# EasyEDA Pro project ProProject_ESP32_lvgl_2024-08-28.epro

# Schematic Schematic1

## Sheets
1 P1: Create Date: 2024-05-08; Page Name: P1; Project Name: ESP32_lvgl; Schematic Name: Schematic1; Update Date: 2024-05-22; Company: 嘉立创EDA; Page Size: A4; Version: V1.0
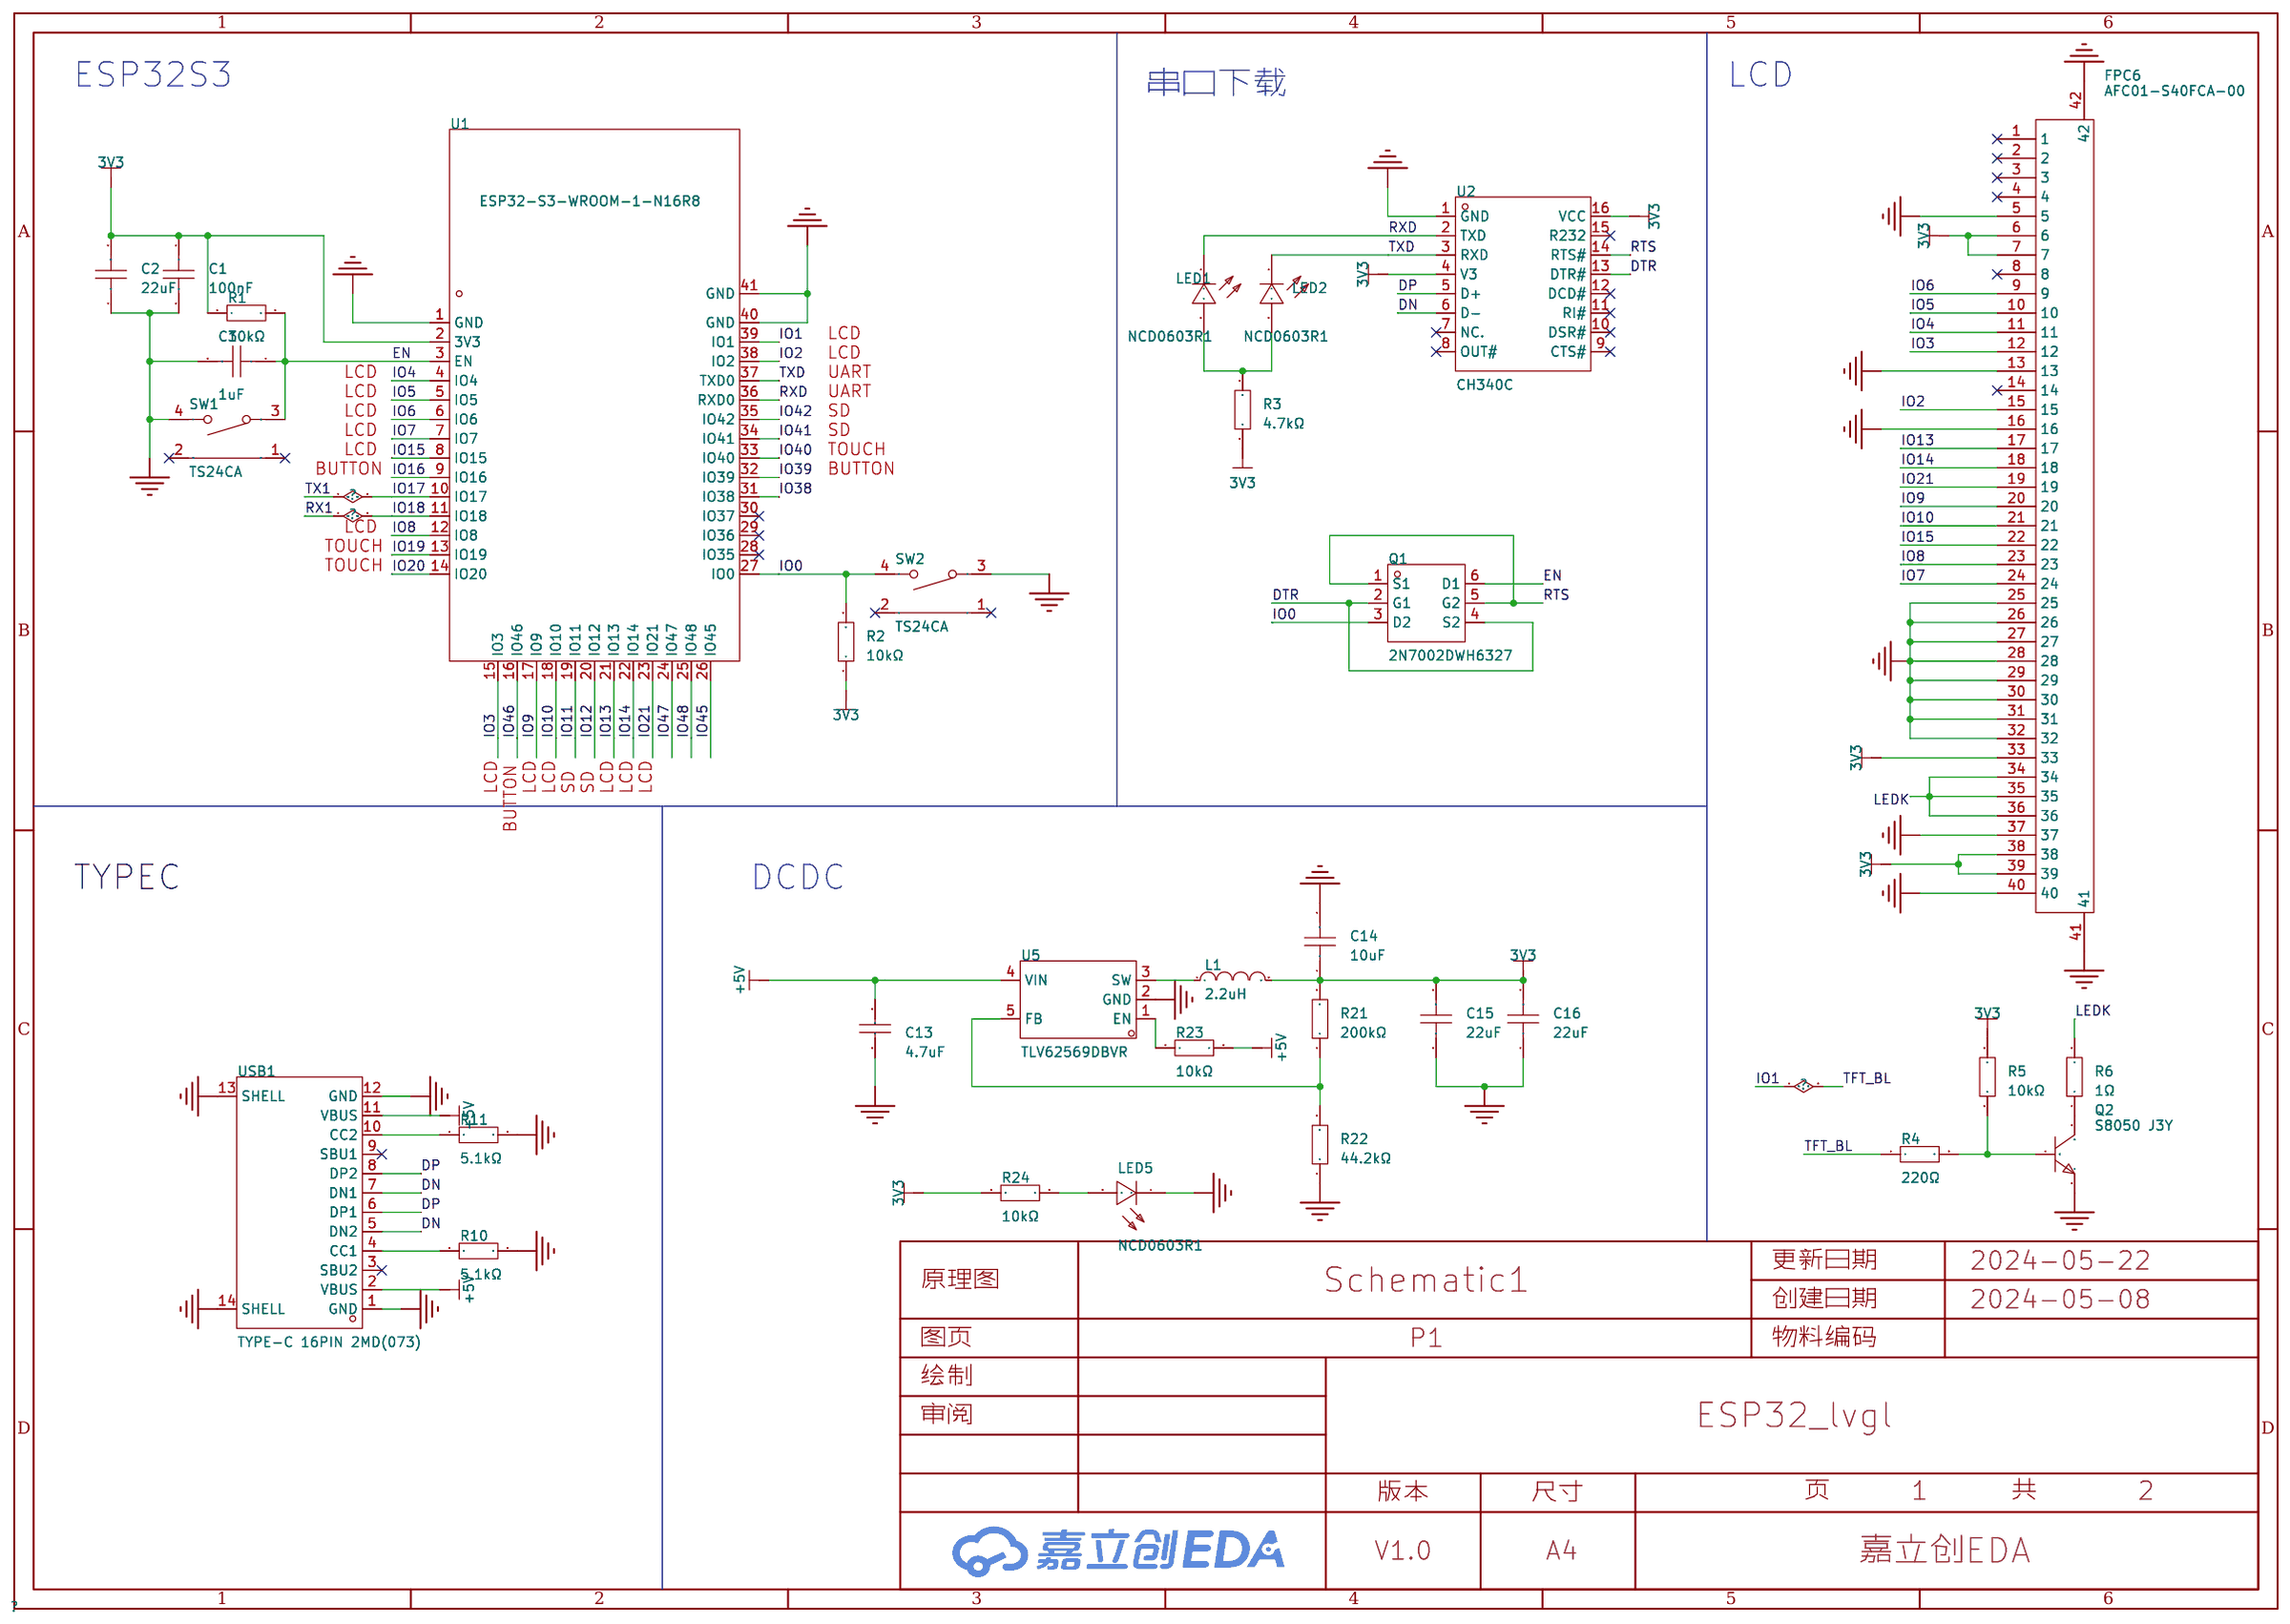
[diagram p0: P1]
2 P2: Create Date: 2024-05-10; Page Name: P2
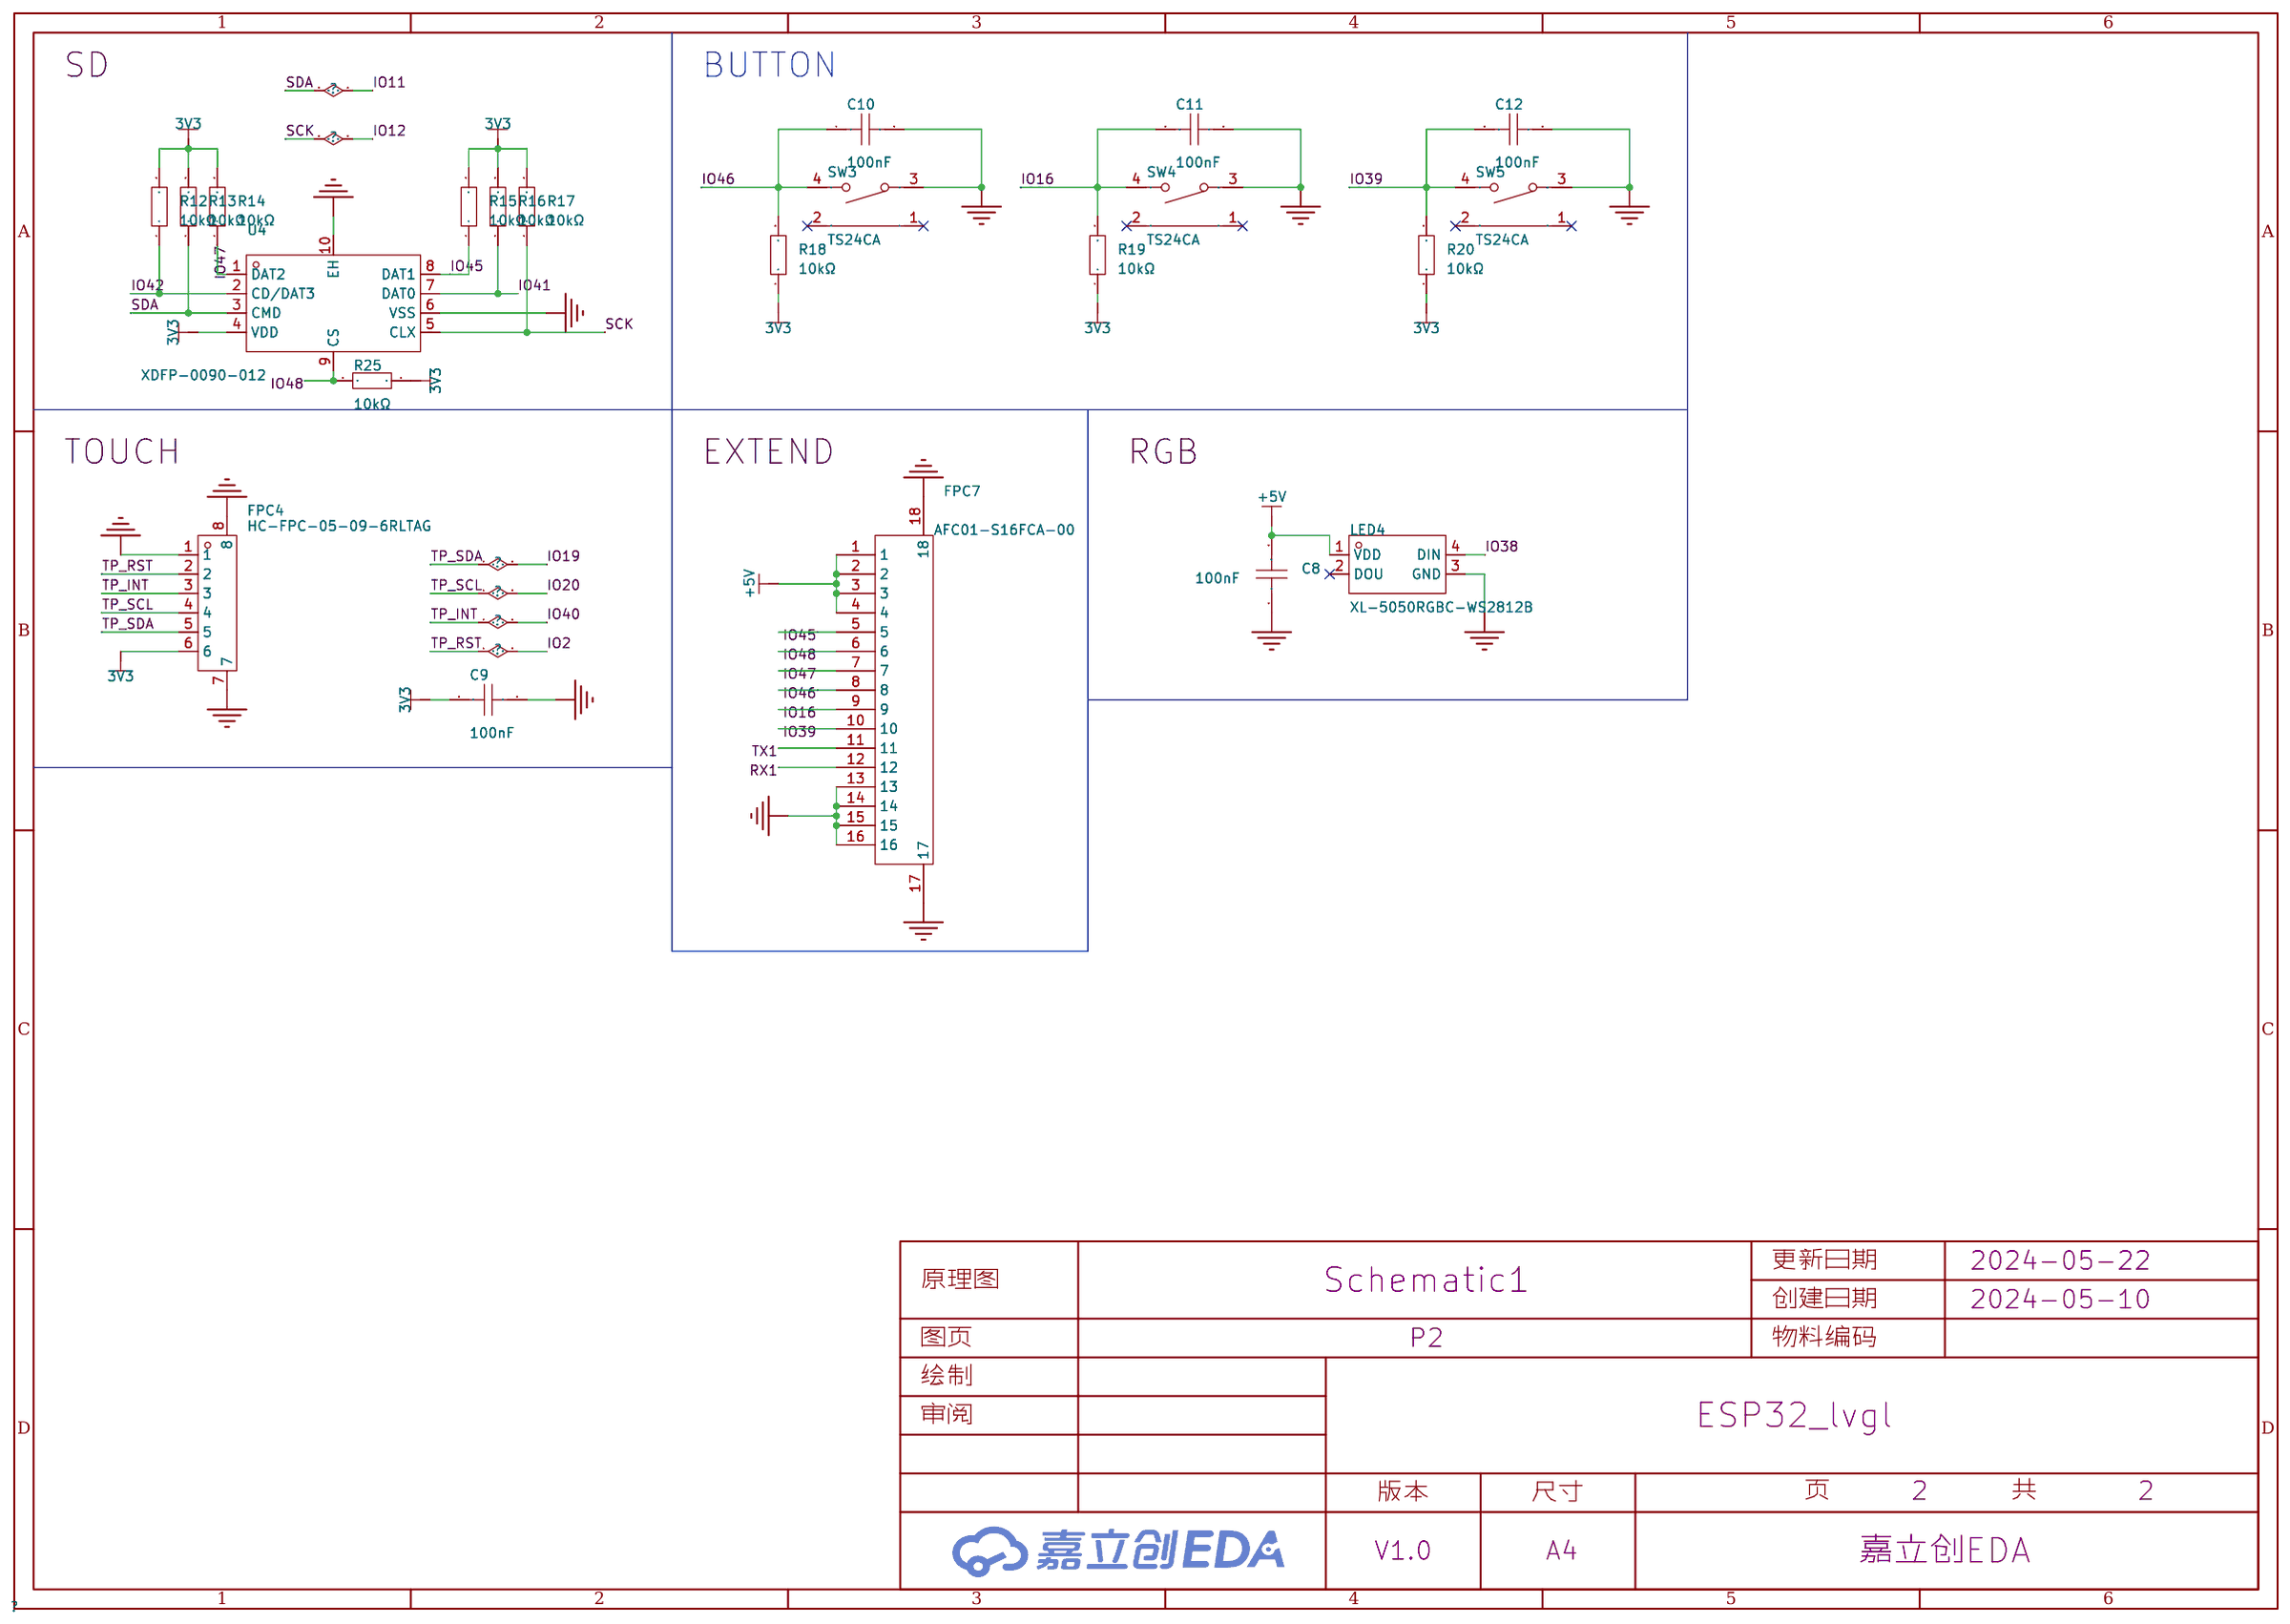
[diagram p1: P2]

## Parts
sheet P1
C1  100nF  [C0603]
C2  22uF  [C0603]
C3  1uF  [C0603]
C13  4.7uF  [C0805]
C14  10uF  [C0603]
C15  22uF  [C0603]
C16  22uF  [C0603]
FPC6  AFC01-S40FCA-00  [FPC-SMD_P0.50-40P_FGS-XJ-H2.0]
L1  2.2uH  [IND-SMD_L7.0-W6.6]
LED1  NCD0603R1  [LED0603-RD_RED]
LED2  NCD0603R1  [LED0603-RD_RED]
LED5  NCD0603R1  [LED0603-RD_RED]
Q1  2N7002DWH6327  [SOT-363_L2.0-W1.3-P0.65-LS2.1-BR]
Q2  S8050 J3Y  [SOT-23-3_L3.0-W1.7-P0.95-LS2.9-BR]
R1  10kΩ  [R0603]
R2  10kΩ  [R0603]
R3  4.7kΩ  [R0603]
R4  220Ω  [R0603]
R5  10kΩ  [R0603]
R6  1Ω  [R0603]
R10  5.1kΩ  [R0603]
R11  5.1kΩ  [R0603]
R21  200kΩ  [R0603]
R22  44.2kΩ  [R0603]
R23  10kΩ  [R0603]
R24  10kΩ  [R0603]
SW1  TS24CA  [SW-SMD_TS24CA]
SW2  TS24CA  [SW-SMD_TS24CA]
U1  ESP32-S3-WROOM-1-N16R8  [WIRELM-SMD_ESP32-S3-WROOM-1]
U2  CH340C  [SOP-16_L10.0-W3.9-P1.27-LS6.0-BL]
U5  TLV62569DBVR  [SOT-23-5_L3.0-W1.7-P0.95-LS2.8-BR]
USB1  TYPE-C 16PIN 2MD(073)  [USB-C-SMD_TYPE-C-6PIN-2MD-073]
sheet P2
C8  100nF  [C0603]
C9  100nF  [C0603]
C10  100nF  [C0603]
C11  100nF  [C0603]
C12  100nF  [C0603]
FPC4  HC-FPC-05-09-6RLTAG  [FPC-SMD_6P-P0.50_HC-FPC-05-09-6RLTAG]
FPC7  AFC01-S16FCA-00  [FPC-SMD_P0.50-16P_FGS-XJ-H2.0]
LED4  XL-5050RGBC-WS2812B  [LED-SMD_4P-L5.0-W5.0-BL_XL-5050RGBC]
R12  10kΩ  [R0603]
R13  10kΩ  [R0603]
R14  10kΩ  [R0603]
R15  10kΩ  [R0603]
R16  10kΩ  [R0603]
R17  10kΩ  [R0603]
R18  10kΩ  [R0603]
R19  10kΩ  [R0603]
R20  10kΩ  [R0603]
R25  10kΩ  [R0603]
SW3  TS24CA  [SW-SMD_TS24CA]
SW4  TS24CA  [SW-SMD_TS24CA]
SW5  TS24CA  [SW-SMD_TS24CA]
U4  XDFP-0090-012  [SIM-SMD_LX_XDFP-0090-012]

## Library data of the parts
C1 C8-C12 = CC0603KRX7R9BB104: 容值:100nF;精度:±10%;额定电压:50V;材质(温度系数):X7R;; LCSC Part Name: 100nF ±10% 50V; Supplier Part: C14663; Manufacturer: YAGEO(国巨); Supplier Footprint: 0603; JLCPCB Part Class: 基础库; Datasheet: https://atta.szlcsc.com/upload/public/pdf/source/20180910/C282072_33301C7F631E79921B82A8DAC6BCC5B3.pdf; Supplier: LCSC; Tolerance: ±10%; Voltage Rated: 50V; Temperature Coefficient: X7R
C2 = CL10A226MP8NUNE: 容值:22uF;精度:±20%;额定电压:10V;材质(温度系数):X5R;; LCSC Part Name: 22uF ±20% 10V; Supplier Part: C86295; Manufacturer: SAMSUNG(三星); Supplier Footprint: 0603; JLCPCB Part Class: 扩展库; Datasheet: https://atta.szlcsc.com/upload/public/pdf/source/20160218/1457707763339.pdf; Supplier: LCSC; Tolerance: ±20%; Voltage Rated: 10V; Temperature Coefficient: X5R
C3 = CL10A105KB8NNNC: 容值:1uF;精度:±10%;额定电压:50V;材质(温度系数):X5R;; LCSC Part Name: 1uF ±10% 50V; Supplier Part: C15849; Manufacturer: SAMSUNG(三星); Supplier Footprint: 0603; JLCPCB Part Class: 基础库; Datasheet: https://atta.szlcsc.com/upload/public/pdf/source/20160218/1457707763339.pdf; Supplier: LCSC; Tolerance: ±10%; Voltage Rated: 50V; Temperature Coefficient: X5R
C13 = CL21A475KAQNNNE: 容值:4.7uF;精度:±10%;额定电压:25V;材质(温度系数):X5R;; LCSC Part Name: 4.7uF ±10% 25V; Supplier Part: C1779; Manufacturer: SAMSUNG(三星); Supplier Footprint: 0805; JLCPCB Part Class: 基础库; Datasheet: https://atta.szlcsc.com/upload/public/pdf/source/20160218/1457707763339.pdf; Supplier: LCSC; Tolerance: ±10%; Voltage Rated: 25V; Temperature Coefficient: X5R
C14 = CL10A106MQ8NNNC: 容值:10uF;精度:±20%;额定电压:6.3V;材质(温度系数):X5R;; LCSC Part Name: 10uF ±20% 6.3V; Supplier Part: C1691; Manufacturer: SAMSUNG(三星); Supplier Footprint: 0603; JLCPCB Part Class: 扩展库; Datasheet: https://atta.szlcsc.com/upload/public/pdf/source/20160218/1457707763339.pdf; Supplier: LCSC; Tolerance: ±20%; Voltage Rated: 6.3V; Temperature Coefficient: X5R
C15 C16 = CL10A226MQ8NRNC: 容值:22uF;精度:±20%;额定电压:6.3V;材质(温度系数):X5R;; LCSC Part Name: 22uF ±20% 6.3V; Supplier Part: C59461; Manufacturer: SAMSUNG(三星); Supplier Footprint: 0603; JLCPCB Part Class: 基础库; Datasheet: https://atta.szlcsc.com/upload/public/pdf/source/20160218/1457707763339.pdf; Supplier: LCSC; Tolerance: ±20%; Voltage Rated: 6.3V; Temperature Coefficient: X5R
FPC6 = AFC01-S40FCA-00: 锁定特性:翻盖式;触点类型:下接;触点数量:40P;间距:0.5mm;安装类型:卧贴;; LCSC Part Name: 间距:0.5mm P数:40P 翻盖式 下接; Supplier Part: C262674; Manufacturer: JS(钜硕电子); Supplier Footprint: SMD,P=0.5mm,卧贴; JLCPCB Part Class: 扩展库; Datasheet: https://atta.szlcsc.com/upload/public/pdf/source/20190816/C413942_2A72D1AC756EAE17EEDF756A339D4500.pdf; Supplier: LCSC; Locking Feature: 翻盖式; Contact Type: 下接; Number of Contacts: 40P; Pitch: 0.5mm; Mounting Type: 卧贴; FFC, FCB Thickness: 0.3mm; Height Above Board: 2mm
L1 = FXL0630-2R2-M: 电感值:2.2uH;精度:±20%;额定电流:9.5A;饱和电流(Isat):10A;类型:一体成型电感;; LCSC Part Name: 2.2uH ±20% 10A; Supplier Part: C167218; Manufacturer: cjiang(长江微电); Supplier Footprint: SMD,6.6x7mm; JLCPCB Part Class: 扩展库; Datasheet: https://atta.szlcsc.com/upload/public/pdf/source/20230516/3A080F5AF8C87BB81C3BA86E5F60E51A.pdf; Supplier: LCSC; Tolerance: ±20%; Rated Current: 9.5A; Saturation Current (Isat): 10A; DC Resistance (DCR): 15mΩ; Type: 一体成型电感
LED1 LED2 LED5 = NCD0603R1_C84263: 灯头类型:-;发光颜色:红色;正向电压(VF):1.6V~2.6V;功率:65mW;正向电流:20mA;主波长:615nm~630nm;二极管配置:独立二极管;透镜颜色:无色透明透镜;色温:-;发光强度:80mcd~220mcd;发光角度:130°;载带方式:-;工作温度:-30℃~+85℃;; Supplier Part: C84263; Manufacturer: 国星光电; Supplier Footprint: 0603; JLCPCB Part Class: 扩展库; Datasheet: https://atta.szlcsc.com/upload/public/pdf/source/20200820/C84263_DABC6A75E58F576973B407FDBA283D60.pdf; Supplier: LCSC; Emitted Color: 红色; Forward Voltage (VF): 1.6V~2.6V; Power Dissipation: 65mW; Forward Current: 20mA; Dominant Wavelength: 615nm~630nm; Diode Configuration: 独立二极管; Lens Color: 无色透明透镜; Luminous Intensity: 80mcd~220mcd; Viewing Angle: 130°; Operating Temperature: -30℃~+85℃
Q1 = 2N7002DWH6327: 类型:2个N沟道;漏源电压(Vdss):60V;连续漏极电流(Id):300mA;功率(Pd):500mW;导通电阻(RDS(on)@Vgs,Id):3Ω@10V,500mA;阈值电压(Vgs(th)@Id):2.5V@250uA;; LCSC Part Name: 2个N沟道 耐压:60V 电流:300mA; Supplier Part: C151535; Manufacturer: Infineon(英飞凌); Supplier Footprint: SC-70-6(SOT-363); JLCPCB Part Class: 扩展库; Datasheet: https://atta.szlcsc.com/upload/public/pdf/source/20180112/C151535_15157256538381261466.pdf; Supplier: LCSC; Type: 2个N沟道; Drain Source Voltage (Vdss): 60V; Continuous Drain Current (Id): 300mA; Power Dissipation (Pd): 500mW; Drain Source On Resistance (RDS(on)@Vgs,Id): 3Ω@10V,500mA; Gate Threshold Voltage (Vgs(th)@Id): 2.5V@250uA
Q2 = S8050 J3Y_C2146: 晶体管类型:NPN;集电极电流(Ic):500mA;集射极击穿电压(Vceo):25V;功率(Pd):300mW;直流电流增益(hFE@Ic,Vce):200@50mA,1V;; LCSC Part Name: S8050 J3Y(RANGE:200-350) H档(200-350); Supplier Part: C2146; Manufacturer: CJ(江苏长电/长晶); Supplier Footprint: SOT-23; JLCPCB Part Class: 基础库; Datasheet: https://atta.szlcsc.com/upload/public/pdf/source/20140809/1457707209234.pdf; Supplier: LCSC; Transistor Type: NPN; Collector Current (Ic): 500mA; Collector-Emitter Breakdown Voltage (Vceo): 25V; Power Dissipation (Pd): 300mW; DC Current Gain (hFE@Ic,Vce): 200@50mA,1V; Transition Frequency (fT): 150MHz; Collector Cut-Off Current (Icbo): 100nA; Collector-Emitter Saturation Voltage (VCE(sat)@Ic,Ib): 600mV@500mA,50mA
R1 R2 R5 R12-R20 R23-R25 = 0603WAF1002T5E: 电阻类型:厚膜电阻;阻值:10kΩ;精度:±1%;功率:100mW;最大工作电压:75V;温度系数:±100ppm/℃;; LCSC Part Name: 厚膜电阻 10kΩ ±1% 100mW; Supplier Part: C25804; Manufacturer: UNI-ROYAL(厚声); Supplier Footprint: 0603; JLCPCB Part Class: 基础库; Datasheet: https://atta.szlcsc.com/upload/public/pdf/source/20200306/C422600_1E6D84923E4A46A82E41ADD87F860B5C.pdf; Supplier: LCSC; Type: 厚膜电阻; Tolerance: ±1%; Power(Watts): 100mW; Overload Voltage (Max): 75V; Temperature Coefficient: ±100ppm/℃; Operating Temperature Range: -55℃~+155℃
R3 = 0603WAF4701T5E: 电阻类型:厚膜电阻;阻值:4.7kΩ;精度:±1%;功率:100mW;最大工作电压:75V;温度系数:±100ppm/℃;; LCSC Part Name: 4.7kΩ ±1% 100mW 厚膜电阻; Supplier Part: C23162; Manufacturer: UNI-ROYAL(厚声); Supplier Footprint: 0603; JLCPCB Part Class: 基础库; Datasheet: https://atta.szlcsc.com/upload/public/pdf/source/20200306/C422600_1E6D84923E4A46A82E41ADD87F860B5C.pdf; Supplier: LCSC; Type: 厚膜电阻; Tolerance: ±1%; Power(Watts): 100mW; Overload Voltage (Max): 75V; Temperature Coefficient: ±100ppm/℃; Operating Temperature Range: -55℃~+155℃
R4 = 0603WAF2200T5E: 电阻类型:厚膜电阻;阻值:220Ω;精度:±1%;功率:100mW;最大工作电压:75V;温度系数:±100ppm/℃;; LCSC Part Name: 220Ω ±1% 100mW 厚膜电阻; Supplier Part: C22962; Manufacturer: UNI-ROYAL(厚声); Supplier Footprint: 0603; JLCPCB Part Class: 基础库; Datasheet: https://atta.szlcsc.com/upload/public/pdf/source/20200306/C422600_1E6D84923E4A46A82E41ADD87F860B5C.pdf; Supplier: LCSC; Type: 厚膜电阻; Tolerance: ±1%; Power(Watts): 100mW; Overload Voltage (Max): 75V; Temperature Coefficient: ±100ppm/℃; Operating Temperature Range: -55℃~+155℃
R6 = 0603WAF100KT5E: 电阻类型:厚膜电阻;阻值:1Ω;精度:±1%;功率:100mW;最大工作电压:75V;温度系数:±400ppm/℃;; LCSC Part Name: 1Ω ±1% 100mW 厚膜电阻; Supplier Part: C22936; Manufacturer: UNI-ROYAL(厚声); Supplier Footprint: 0603; JLCPCB Part Class: 基础库; Datasheet: https://atta.szlcsc.com/upload/public/pdf/source/20200306/C422600_1E6D84923E4A46A82E41ADD87F860B5C.pdf; Supplier: LCSC; Type: 厚膜电阻; Tolerance: ±1%; Power(Watts): 100mW; Overload Voltage (Max): 75V; Temperature Coefficient: ±400ppm/℃; Operating Temperature Range: -55℃~+155℃
R10 R11 = 0603WAF5101T5E: 电阻类型:厚膜电阻;阻值:5.1kΩ;精度:±1%;功率:100mW;最大工作电压:75V;温度系数:±100ppm/℃;; LCSC Part Name: 5.1kΩ ±1% 100mW 厚膜电阻; Supplier Part: C23186; Manufacturer: UNI-ROYAL(厚声); Supplier Footprint: 0603; JLCPCB Part Class: Basic Part; Datasheet: https://atta.szlcsc.com/upload/public/pdf/source/20200306/C422600_1E6D84923E4A46A82E41ADD87F860B5C.pdf; Supplier: LCSC; Type: 厚膜电阻; Tolerance: ±1%; Power(Watts): 100mW; Overload Voltage (Max): 75V; Temperature Coefficient: ±100ppm/℃; Operating Temperature Range: -55℃~+155℃
R21 = 0603WAF2003T5E: 电阻类型:厚膜电阻;阻值:200kΩ;精度:±1%;功率:100mW;最大工作电压:75V;温度系数:±100ppm/℃;; LCSC Part Name: 200kΩ ±1% 100mW 厚膜电阻; Supplier Part: C25811; Manufacturer: UNI-ROYAL(厚声); Supplier Footprint: 0603; JLCPCB Part Class: 基础库; Datasheet: https://atta.szlcsc.com/upload/public/pdf/source/20200306/C422600_1E6D84923E4A46A82E41ADD87F860B5C.pdf; Supplier: LCSC; Type: 厚膜电阻; Tolerance: ±1%; Power(Watts): 100mW; Overload Voltage (Max): 75V; Temperature Coefficient: ±100ppm/℃; Operating Temperature Range: -55℃~+155℃
R22 = 0603WAF4422T5E: 电阻类型:厚膜电阻;阻值:44.2kΩ;精度:±1%;功率:100mW;最大工作电压:75V;温度系数:±100ppm/℃;; LCSC Part Name: 44.2kΩ ±1% 100mW 厚膜电阻; Supplier Part: C23056; Manufacturer: UNI-ROYAL(厚声); Supplier Footprint: 0603; JLCPCB Part Class: 扩展库; Datasheet: https://atta.szlcsc.com/upload/public/pdf/source/20200306/C422600_1E6D84923E4A46A82E41ADD87F860B5C.pdf; Supplier: LCSC; Type: 厚膜电阻; Tolerance: ±1%; Power(Watts): 100mW; Overload Voltage (Max): 75V; Temperature Coefficient: ±100ppm/℃; Operating Temperature Range: -55℃~+155℃
SW1-SW5 = TS24CA: 电路结构:单刀单掷;按钮形状:矩形按钮;安装方式:卧贴;开关长度:4.55mm;开关宽度:1.8mm;开关高度:3.5mm;触点电流:50mA;额定电压(DC):12V;带灯:-;机械寿命:-;; LCSC Part Name: 4.55*1.8*3.5mm 卧贴 轻触开关; Supplier Part: C393942; Manufacturer: SHOU HAN(首韩); Supplier Footprint: SMD; JLCPCB Part Class: 扩展库; Datasheet: https://atta.szlcsc.com/upload/public/pdf/source/20190521/C393942_591A9E318887EFA4274D34029981AD99.pdf; Supplier: LCSC; Circuit: 单刀单掷; Actuator Style: 矩形按钮; Mounting Style: 卧贴; Switch Length: 4.55mm; Switch Width: 1.8mm; Switch Height: 3.5mm; Contact Current: 50mA; Voltage Rating (DC): 12V
U1 = ESP32-S3-WROOM-1-N16R8: LCSC Part Name: 通用型Wi-Fi+低功耗蓝牙MCU模组; Supplier Part: C2913202; Manufacturer: ESPRESSIF(乐鑫); Supplier Footprint: SMD,18x25.5mm; JLCPCB Part Class: 扩展库; Datasheet: https://atta.szlcsc.com/upload/public/pdf/source/20220705/4E799F39581577F766659887F738A439.pdf; Supplier: LCSC
U2 = CH340C: 应用功能:收发器;接口协议:USB 2.0;数据速率:2Mbps;; LCSC Part Name: CH340C USB转串口芯片 CH340; Supplier Part: C84681; Manufacturer: WCH(南京沁恒); Supplier Footprint: SOP-16; JLCPCB Part Class: 扩展库; Datasheet: https://atta.szlcsc.com/upload/public/pdf/source/20200819/C84681_ADBED554CE321879DBD6B1D06488689C.pdf; Supplier: LCSC; Applications Function: 收发器; Protocol: USB 2.0; Supply Voltage: 3.3V；5V; Data Rate: 2Mbps
U5 = TLV62569DBVR: 功能类型:降压型;输出类型:可调;输入电压:2.5V~5.5V;输出电压:600mV~5.5V;输出电流(最大值):2A;; Supplier Part: C141836; Manufacturer: TI(德州仪器); Supplier Footprint: SOT-23-5; JLCPCB Part Class: 扩展库; Datasheet: https://www.ti.com/cn/lit/gpn/tlv62569; Supplier: LCSC; Function: 降压型; Output Type: 可调; Input Voltage: 2.5V~5.5V; Output Voltage: 600mV~5.5V; Output Current (Max): 2A; Switching Frequency: 1.5MHz; Operating Temperature: -40℃~+125℃@(TJ); Synchronous Rectification: 是; Topology: 降压式; Switch tube (built-in/external): 内置
USB1 = TYPE-C 16PIN 2MD(073): 连接器类型:Type-C;标准:-;公母:母;端口数量:1;触点数量:16P;安装方式:卧贴;额定电流 - 电源:5A;工作温度范围:-25℃~+85℃;; LCSC Part Name: Type-C 母 卧贴; Supplier Part: C2765186; Manufacturer: SHOU HAN(首韩); Supplier Footprint: SMD; JLCPCB Part Class: 扩展库; Datasheet: https://atta.szlcsc.com/upload/public/pdf/source/20211123/39B17C16241EAC15C5E277BDA434118E.pdf; Supplier: LCSC; Connector Type: Type-C; Gender: 母; Number of Ports: 1; Number of Contacts: 16P; Mounting Style: 卧贴; Current Rating - Power (Max): 5A; Operating Temperature Range: -25℃~+85℃
FPC4 = HC-FPC-05-09-6RLTAG: 锁定特性:翻盖式;触点类型:双侧触点/上下接;触点数量:6P;间距:0.5mm;安装类型:卧贴;工作温度范围:-55℃~+85℃;; LCSC Part Name: 翻盖式 双侧触点/上下接 P数:6P 间距:0.5mm; Supplier Part: C5213748; Manufacturer: HCTL(华灿天禄); Supplier Footprint: SMD,P=0.5mm,卧贴; JLCPCB Part Class: 扩展库; Datasheet: https://atta.szlcsc.com/upload/public/pdf/source/20221026/52A26161A88FCE07A06989F8D4399614.pdf; Supplier: LCSC; Locking Feature: 翻盖式; Contact Type: 双侧触点/上下接; Number of Contacts: 6P; Pitch: 0.5mm; Mounting Type: 卧贴; FFC, FCB Thickness: 0.3mm; Height Above Board: 1mm; Contact Material: 铜合金; Operating Temperature Range: -55℃~+85℃
FPC7 = AFC01-S16FCA-00: 锁定特性:翻盖式;触点类型:下接;触点数量:16P;间距:0.5mm;安装类型:卧贴;; LCSC Part Name: 间距:0.5mm P数:16P 翻盖式 下接; Supplier Part: C262665; Manufacturer: JS(钜硕电子); Supplier Footprint: SMD,P=0.5mm,卧贴; JLCPCB Part Class: 扩展库; Datasheet: https://atta.szlcsc.com/upload/public/pdf/source/20190816/C413942_2A72D1AC756EAE17EEDF756A339D4500.pdf; Supplier: LCSC; Locking Feature: 翻盖式; Contact Type: 下接; Number of Contacts: 16P; Pitch: 0.5mm; Mounting Type: 卧贴; FFC, FCB Thickness: 0.3mm; Height Above Board: 2mm
LED4 = XL-5050RGBC-WS2812B: 5050七彩幻彩透明贴片LED灯珠 5050 幻彩透明四脚 ws2812B 内置驱动IC; Supplier Part: C2843785; Manufacturer: XINGLIGHT(成兴光); Supplier Footprint: SMD5050; JLCPCB Part Class: 扩展库; Datasheet: https://atta.szlcsc.com/upload/public/pdf/source/20240412/E1004CAA80592E31D08BFE019083806F.pdf; Supplier: LCSC
U4 = XDFP-0090-012: 卡连接方式:自弹式;本体最大高度:1.85mm;触头镀层:金;; LCSC Part Name: 自弹式外焊 Micro SD卡座/TF卡座9PIN; Supplier Part: C7498122; Manufacturer: LX(连欣科技); Supplier Footprint: SMD; JLCPCB Part Class: 扩展库; Datasheet: https://atta.szlcsc.com/upload/public/pdf/source/20230919/3284334F72F9F9D639C35504FE7D1962.pdf; Supplier: LCSC; Card Connection Mode: 自弹式; Body Height (Max): 1.85mm; Contact Plating: 金

## Nets
3V3: C1.1 C2.2 C9.2 C14.1 C15.2 C16.2 FPC4.6 FPC6.6 FPC6.7 FPC6.33 FPC6.38 FPC6.39 L1.2 R1.1 R2.1 R3.1 R5.2 R12.2 R13.2 R14.2 R15.2 R16.2 R17.2 R18.1 R19.1 R20.1 R21.2 R24.1 R25.1 U1.2(3V3) U2.4(V3) U2.16(VCC) U4.4(VDD)
+5V: C8.2 C13.2 FPC7.1 FPC7.2 FPC7.3 FPC7.4 LED4.1(VDD) R23.2 U5.4(VIN) USB1.2(VBUS) USB1.11(VBUS)
GND: C1.2 C2.1 C3.2 C8.1 C9.1 C10.2 C11.2 C12.2 C13.1 C14.2 C15.1 C16.1 FPC4.1 FPC4.7 FPC4.8 FPC6.5 FPC6.13 FPC6.16 FPC6.25 FPC6.26 FPC6.27 FPC6.28 FPC6.29 FPC6.30 FPC6.31 FPC6.32 FPC6.37 FPC6.40 FPC6.41 FPC6.42 FPC7.13 FPC7.14 FPC7.15 FPC7.16 FPC7.17 FPC7.18 LED4.3(GND) LED5.1(K) Q2.2(E) R10.2 R11.2 R22.1 SW1.4 SW2.3 SW3.3 SW4.3 SW5.3 U1.1(GND) U1.40(GND) U1.41(GND) U2.1(GND) U4.6(VSS) U4.10(EH) U5.2(GND) USB1.1(GND) USB1.12(GND) USB1.13(SHELL) USB1.14(SHELL)
DN: U2.6(D-) USB1.5(DN2) USB1.7(DN1)
DP: U2.5(D+) USB1.6(DP1) USB1.8(DP2)
DTR: Q1.2(G1) Q1.4(S2) U2.13(DTR#)
EN: C3.1 Q1.6(D1) R1.2 SW1.3 U1.3(EN)
IO0: Q1.3(D2) R2.2 SW2.4 U1.27(IO0)
IO1: R4.1 U1.39(IO1)
IO2: FPC4.2 FPC6.15 U1.38(IO2)
IO3: FPC6.12 U1.15(IO3)
IO4: FPC6.11 U1.4(IO4)
IO5: FPC6.10 U1.5(IO5)
IO6: FPC6.9 U1.6(IO6)
IO7: FPC6.24 U1.7(IO7)
IO8: FPC6.23 U1.12(IO8)
IO9: FPC6.20 U1.17(IO9)
IO10: FPC6.21 U1.18(IO10)
IO11: R13.1 U1.19(IO11) U4.3(CMD)
IO12: R17.1 U1.20(IO12) U4.5(CLX)
IO13: FPC6.17 U1.21(IO13)
IO14: FPC6.18 U1.22(IO14)
IO15: FPC6.22 U1.8(IO15)
IO16: C11.1 FPC7.9 R19.2 SW4.4 U1.9(IO16)
IO17: FPC7.11 U1.10(IO17)
IO18: FPC7.12 U1.11(IO18)
IO19: FPC4.5 U1.13(IO19)
IO20: FPC4.4 U1.14(IO20)
IO21: FPC6.19 U1.23(IO21)
IO38: LED4.4(DIN) U1.31(IO38)
IO39: C12.1 FPC7.10 R20.2 SW5.4 U1.32(IO39)
IO40: FPC4.3 U1.33(IO40)
IO41: R16.1 U1.34(IO41) U4.7(DAT0)
IO42: R12.1 U1.35(IO42) U4.2(CD/DAT3)
IO45: FPC7.5 R15.1 U1.26(IO45) U4.8(DAT1)
IO46: C10.1 FPC7.8 R18.2 SW3.4 U1.16(IO46)
IO47: FPC7.7 R14.1 U1.24(IO47) U4.1(DAT2)
IO48: FPC7.6 R25.2 U1.25(IO48) U4.9(CS)
LEDK: FPC6.34 FPC6.35 FPC6.36 R6.2
RTS: Q1.1(S1) Q1.5(G2) U2.14(RTS#)
RXD: LED1.1(K) U1.36(RXD0) U2.2(TXD)
TXD: LED2.1(K) U1.37(TXD0) U2.3(RXD)
$1N3136: LED1.2(A) LED2.2(A) R3.2
$1N4482: Q2.3(C) R6.1
$1N4584: Q2.1(B) R4.2 R5.1
$1N6260: R10.1 USB1.4(CC1)
$1N6275: R11.1 USB1.10(CC2)
$1N13069: L1.1 U5.3(SW)
$1N13305: R23.1 U5.1(EN)
$1N13462: LED5.2(A) R24.2
$1N13468: R21.1 R22.2 U5.5(FB)

Not connected (* = marked no-connect by the designer): FPC6 1* 2* 3* 4* 8* 14*; LED4 2(DOU)*; SW1 1* 2*; SW2 1* 2*; SW3 1* 2*; SW4 1* 2*; SW5 1* 2*; U1 28(IO35)* 29(IO36)* 30(IO37)*; U2 7(NC.)* 8(OUT#)* 9(CTS#)* 10(DSR#)* 11(RI#)* 12(DCD#)* 15(R232)*; USB1 3(SBU2)* 9(SBU1)*

## Notes on the sheets
sheet 1
- ESP32S3
- LCD
- 串口下载
- LCD
- LCD
- LCD
- UART
- LCD
- UART
- LCD
- SD
- LCD
- LCD
- SD
- TOUCH
- BUTTON
- BUTTON
- LCD
- TOUCH
- TOUCH
- LCD
- LCD
- LCD
- SD
- SD
- LCD
- LCD
- LCD
- BUTTON
- TYPEC
- DCDC
sheet 2
- SD
- BUTTON
- TOUCH
- EXTEND
- RGB

# Board PCB1
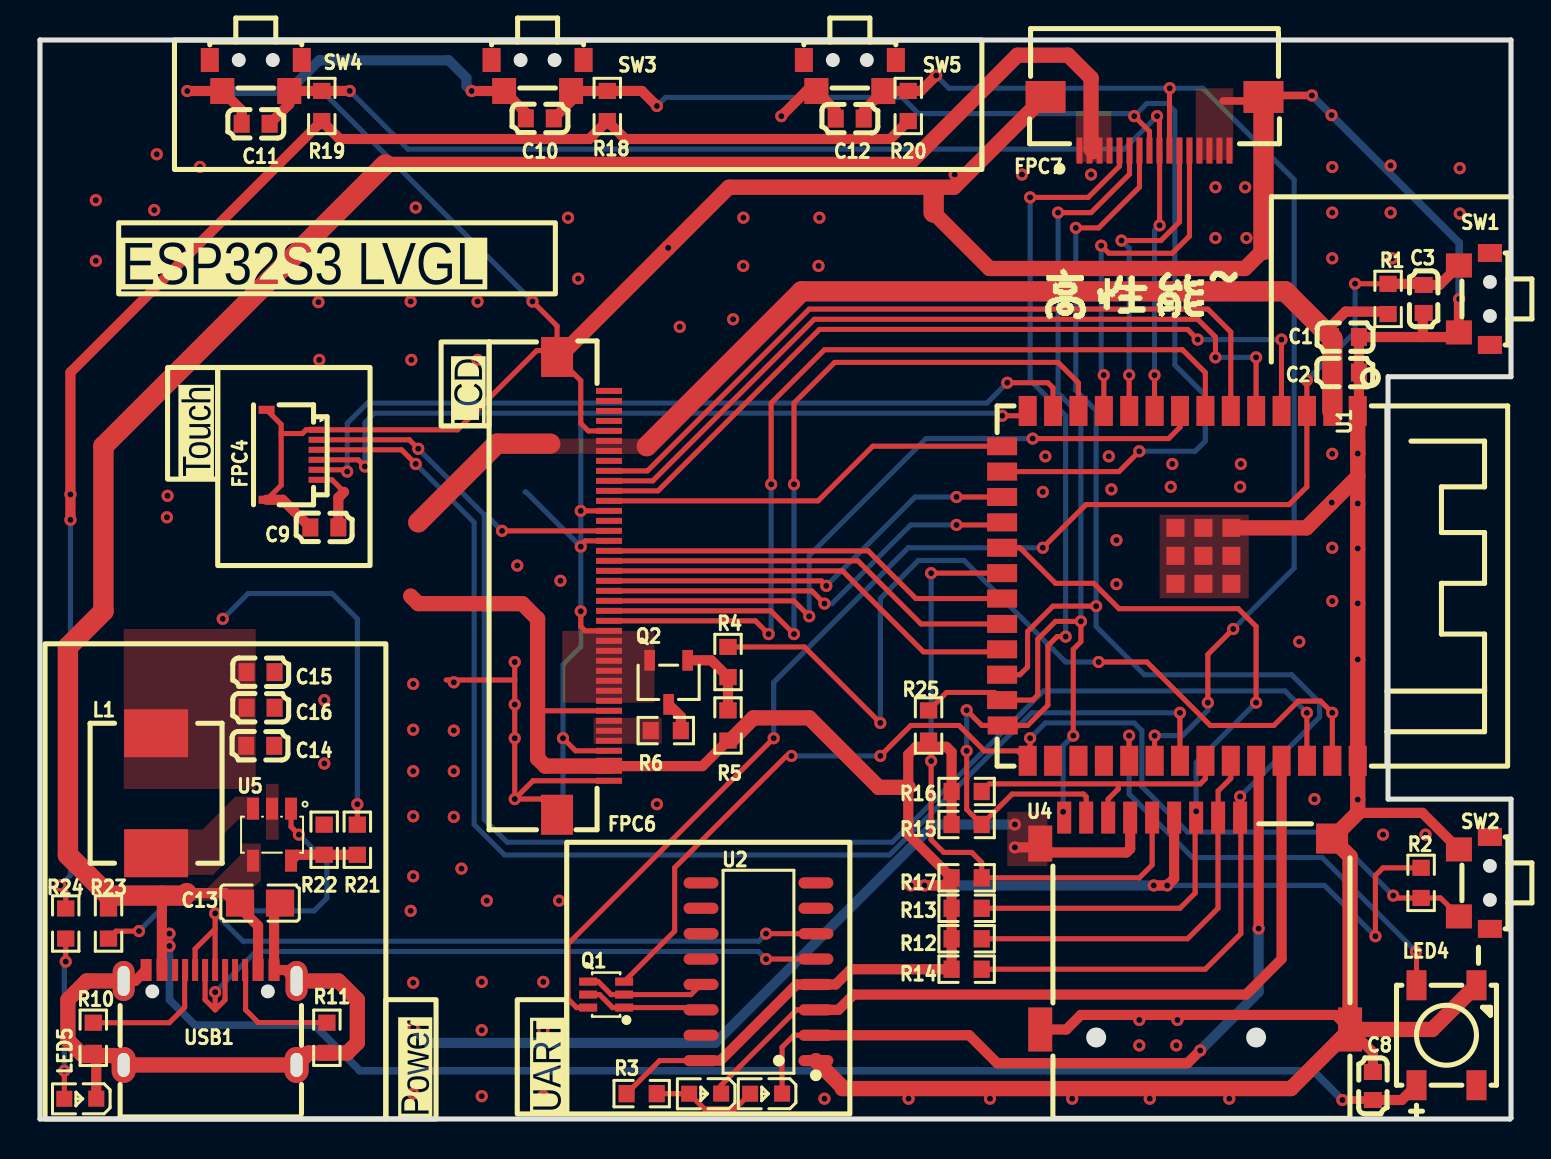
[diagram p2: board, top side]
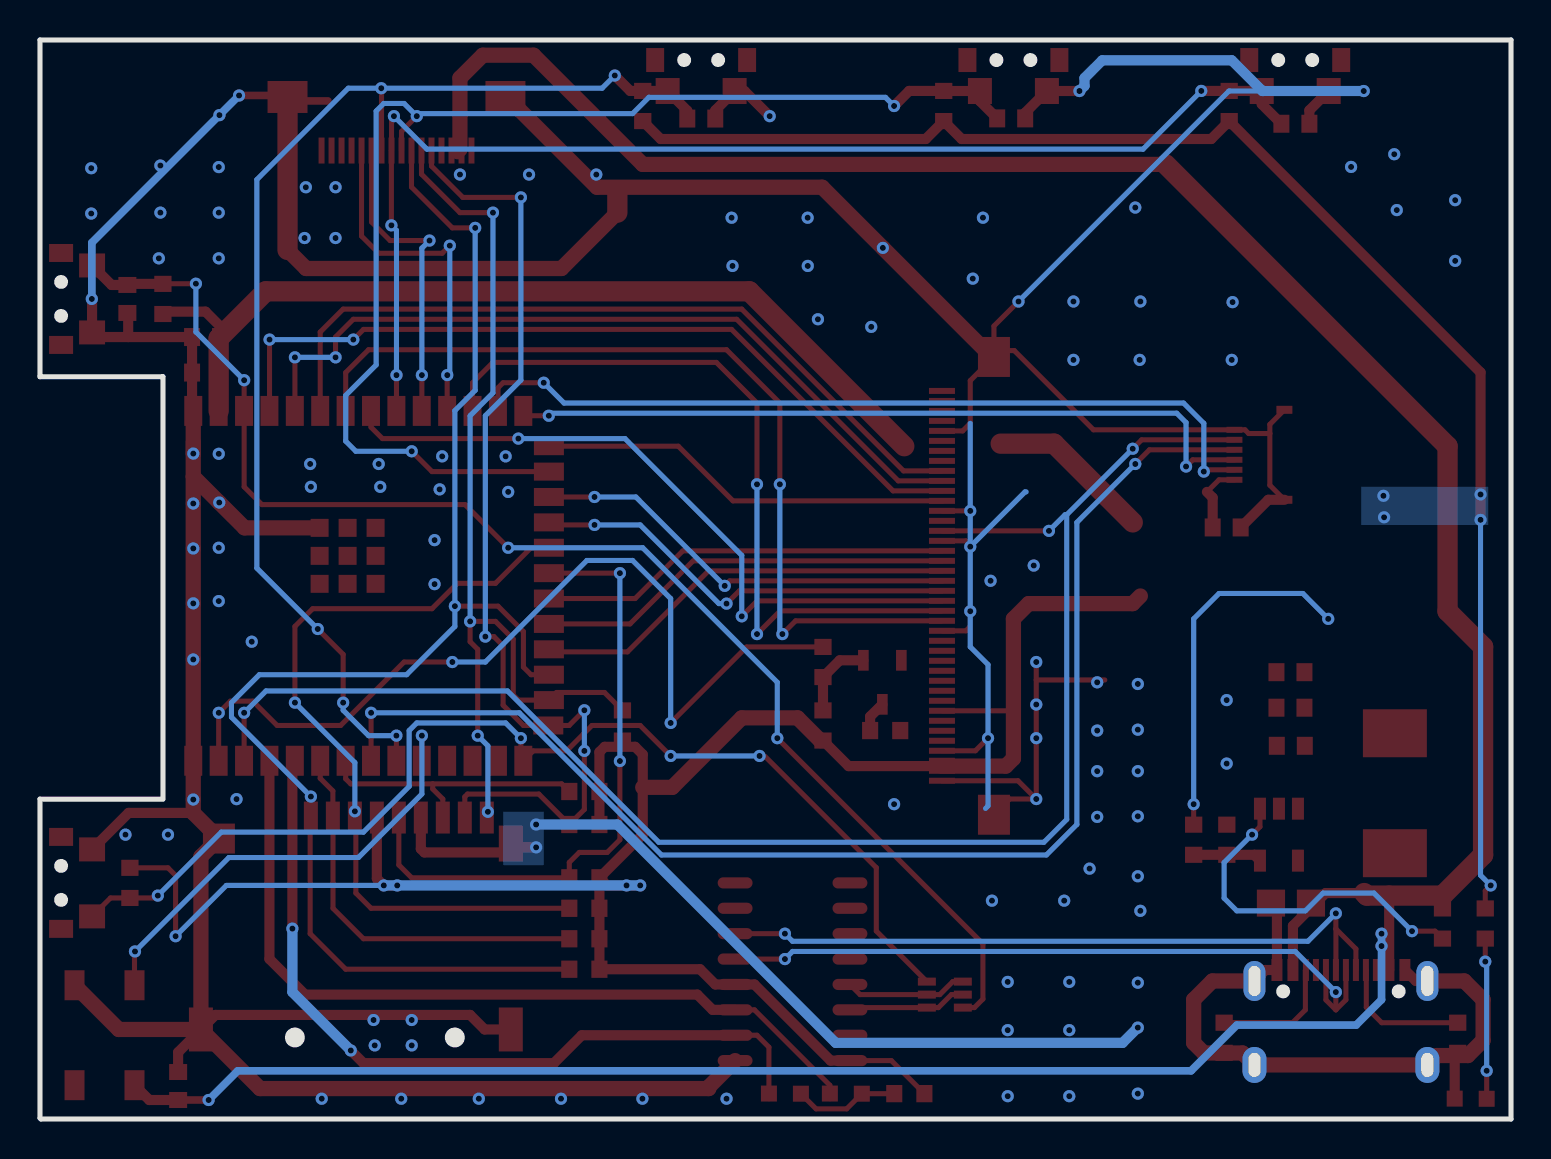
[diagram p3: board, bottom side, seen from below]

Outline 73.59 x 53.97 mm; copper layers: Top Layer, Bottom Layer. Coordinates in mm from the lower left corner of the outline.
Outline path: 0,53.97 73.59,53.97 73.59,37.13 67.44,37.13 67.44,16 73.59,16 73.59,0.05 73.53,0 0,0 0,53.97
Stack: Top Layer 0.035mm / Dielectric1 1.51mm FR4 er 4.5 / Bottom Layer 0.035mm

## Design rules (mm)
template: JLCPCB Capability(Two Layers Board)
spacing copperThickness1oz (default): track to track 0.102, other pairs 0.152 to 0.3
spacing copperThickness2oz: track to track 0.203, other pairs 0.152 to 0.3
track width copperThickness1oz (default): min 0.127, default 0.254, max 2.54
track width copperThickness2oz: min 0.203, default 0.254, max 2.54
differential pair differentialPair (default): width min 0.127, default 0.254, max 2.54; gap min 0.152, default 0.152
via viaSize (default): diameter min 0.5, default 0.61, max 10; hole min 0.3, default 0.305, max 6.3

## Placement (name value [footprint] x y rotation side)
C1  100nF  [C0603]  65.28 37.34 0 top
C2  22uF  [C0603]  65.28 39.12 180 top
C3  1uF  [C0603]  69.21 41.02 270 top
C8  100nF  [C0603]  66.67 1.65 270 top
C9  100nF  [C0603]  14.22 29.59 0 top
C10  100nF  [C0603]  25 50.05 180 top
C11  100nF  [C0603]  10.79 49.78 180 top
C12  100nF  [C0603]  40.51 50.04 180 top
C13  4.7uF  [C0805]  11.01 10.8 180 top
C14  10uF  [C0603]  11.02 18.67 0 top
C15  22uF  [C0603]  11.03 22.35 180 top
C16  22uF  [C0603]  11.03 20.57 180 top
FPC4  HC-FPC-05-09-6RLTAG  [FPC-SMD_6P-P0.50_HC-FPC-05-09-6RLTAG]  12.59 33.22 90 top
FPC6  AFC01-S40FCA-00  [FPC-SMD_P0.50-40P_FGS-XJ-H2.0]  27.17 26.67 90 top
FPC7  AFC01-S16FCA-00  [FPC-SMD_P0.50-16P_FGS-XJ-H2.0]  55.75 49.78 0 top
L1  2.2uH  [IND-SMD_L7.0-W6.6]  5.81 16.3 90 top
LED1  NCD0603R1  [LED0603-RD_RED]  36.32 1.27 180 top
LED2  NCD0603R1  [LED0603-RD_RED]  33.27 1.27 180 top
LED4  XL-5050RGBC-WS2812B  [LED-SMD_4P-L5.0-W5.0-BL_XL-5050RGBC]  70.36 4.19 0 top
LED5  NCD0603R1  [LED0603-RD_RED]  2.02 1.02 180 top
Q1  2N7002DWH6327  [SOT-363_L2.0-W1.3-P0.65-LS2.1-BR]  28.32 6.22 0 top
Q2  S8050 J3Y  [SOT-23-3_L3.0-W1.7-P0.95-LS2.9-BR]  31.45 21.84 90 top
R1  10kΩ  [R0603]  67.44 41.02 90 top
R2  10kΩ  [R0603]  69.09 11.81 270 top
R3  4.7kΩ  [R0603]  30.1 1.27 0 top
R4  220Ω  [R0603]  34.42 22.86 270 top
R5  10kΩ  [R0603]  34.42 19.68 270 top
R6  1Ω  [R0603]  31.31 19.43 180 top
R10  5.1kΩ  [R0603]  2.67 4.06 270 top
R11  5.1kΩ  [R0603]  14.35 4.06 270 top
R12  10kΩ  [R0603]  46.36 9.02 180 top
R13  10kΩ  [R0603]  46.36 10.54 180 top
R14  10kΩ  [R0603]  46.36 7.49 180 top
R15  10kΩ  [R0603]  46.36 14.73 180 top
R16  10kΩ  [R0603]  46.36 16.38 180 top
R17  10kΩ  [R0603]  46.36 12.06 180 top
R18  10kΩ  [R0603]  28.38 50.67 90 top
R19  10kΩ  [R0603]  14.1 50.67 90 top
R20  10kΩ  [R0603]  43.43 50.67 90 top
R21  200kΩ  [R0603]  15.88 13.97 90 top
R22  44.2kΩ  [R0603]  14.22 13.97 270 top
R23  10kΩ  [R0603]  3.43 9.78 90 top
R24  10kΩ  [R0603]  1.29 9.78 270 top
R25  10kΩ  [R0603]  44.45 19.68 90 top
SW1  TS24CA  [SW-SMD_TS24CA]  71.76 41.02 270 top
SW2  TS24CA  [SW-SMD_TS24CA]  71.76 11.81 270 top
SW3  TS24CA  [SW-SMD_TS24CA]  24.89 52.2 0 top
SW4  TS24CA  [SW-SMD_TS24CA]  10.8 52.2 0 top
SW5  TS24CA  [SW-SMD_TS24CA]  40.51 52.2 0 top
U1  ESP32-S3-WROOM-1-N16R8  [WIRELM-SMD_ESP32-S3-WROOM-1]  57.02 26.67 270 top
U2  CH340C  [SOP-16_L10.0-W3.9-P1.27-LS6.0-BL]  35.94 7.37 90 top
U4  XDFP-0090-012  [SIM-SMD_LX_XDFP-0090-012]  57.79 9.78 0 top
U5  TLV62569DBVR  [SOT-23-5_L3.0-W1.7-P0.95-LS2.8-BR]  11.61 14.22 90 top
USB1  TYPE-C 16PIN 2MD(073)  [USB-C-SMD_TYPE-C-6PIN-2MD-073]  8.51 5.08 0 top

## Footprints (pads in the part's own frame, mm; a bottom-side part is the same pattern mirrored in y, then rotated)
C0603
  rect 0.8x0.9 smd: 1(-0.7,0) 2(0.7,0)
C0805
  rect 1.41x1.35 smd: 1(-1,0) 2(1,0)
FPC-SMD_6P-P0.50_HC-FPC-05-09-6RLTAG
  rect 0.3x0.8 smd: 1(1.25,-1.25) 2(0.75,-1.25) 3(0.25,-1.25) 4(-0.25,-1.25) 5(-0.75,-1.25) 6(-1.25,-1.25)
  rect 0.4x0.8 smd: 7(-2.25,1.25) 8(2.25,1.25)
FPC-SMD_P0.50-16P_FGS-XJ-H2.0
  rect 0.3x1.3 smd: 1(-3.752,-1.34) 2(-3.254,-1.339) 3(-2.752,-1.34) 4(-2.252,-1.34) 5(-1.752,-1.34) 6(-1.252,-1.34) 7(-0.752,-1.34) 8(-0.252,-1.34) 9(0.248,-1.34) 10(0.748,-1.34) 11(1.248,-1.34) 12(1.748,-1.34) 13(2.248,-1.34) 14(2.748,-1.34) 15(3.248,-1.34) 16(3.748,-1.34)
  rect 2x1.6 smd: 17(-5.45,1.34) 18(5.45,1.34)
FPC-SMD_P0.50-40P_FGS-XJ-H2.0
  rect 0.3x1.3 smd: 1(9.75,-1.3) 2(9.25,-1.3) 3(8.75,-1.3) 4(8.25,-1.3) 5(7.75,-1.3) 6(7.25,-1.3) 7(6.75,-1.3) 8(6.25,-1.3) 9(5.75,-1.3) 10(5.25,-1.3) 11(4.75,-1.3) 12(4.25,-1.3) 13(3.75,-1.3) 14(3.25,-1.3) 15(2.75,-1.3) 16(2.25,-1.3) 17(1.75,-1.3) 18(1.25,-1.3) 19(0.75,-1.3) 20(0.25,-1.3) 21(-0.25,-1.3) 22(-0.75,-1.3) 23(-1.25,-1.3) 24(-1.75,-1.3) 25(-2.25,-1.3) 26(-2.75,-1.3) 27(-3.25,-1.3) 28(-3.75,-1.3) 29(-4.25,-1.3) 30(-4.75,-1.3) 31(-5.25,-1.3) 32(-5.75,-1.3) 33(-6.25,-1.3) 34(-6.75,-1.3) 35(-7.25,-1.3) 36(-7.75,-1.3) 37(-8.25,-1.3) 38(-8.75,-1.3) 39(-9.25,-1.3) 40(-9.75,-1.3)
  rect 2x1.6 smd: 41(-11.45,1.3) 42(11.45,1.3)
IND-SMD_L7.0-W6.6
  rect 2.4x3.2 smd: 1(-3,0) 2(3,0)
LED0603-RD_RED
  rect 0.8x0.8 smd: 1(-0.799,-0.004) 2(0.799,0.004)
LED-SMD_4P-L5.0-W5.0-BL_XL-5050RGBC
  rect 1x1.5 smd: 1(-1.5,-2.5) 2(1.5,-2.5) 3(1.5,2.5) 4(-1.5,2.5)
R0603
  rect 0.806x0.864 smd: 1(-0.753,0) 2(0.753,0)
SIM-SMD_LX_XDFP-0090-012
  rect 0.7x1.6 smd: 1(2.25,5.3) 2(1.15,5.3) 3(0.05,5.3) 4(-1.05,5.3) 5(-2.15,5.3) 6(-3.25,5.3) 7(-4.35,5.3) 8(-5.45,5.3) 9(-6.55,5.3)
  rect 1.2x1.8 smd: 10(-7.75,4)
  rect 1.2x2.2 smd: 10(-7.75,-5.3) 10(7.75,-5.3)
  rect 1.6x1.5 smd: 10(6.85,4.25)
SOP-16_L10.0-W3.9-P1.27-LS6.0-BL
  oval 0.56x1.745 smd: 1(-4.445,-2.873) 2(-3.175,-2.873) 3(-1.905,-2.873) 4(-0.635,-2.873) 5(0.635,-2.873) 6(1.905,-2.873) 7(3.175,-2.873) 8(4.445,-2.873) 9(4.445,2.873) 10(3.175,2.873) 11(1.905,2.873) 12(0.635,2.873) 13(-0.635,2.873) 14(-1.905,2.873) 15(-3.175,2.873) 16(-4.445,2.873)
SOT-23-3_L3.0-W1.7-P0.95-LS2.9-BR
  rect 1.038x0.532 smd: 1(1.101,-0.95) 2(1.101,0.95) 3(-1.101,0)
SOT-23-5_L3.0-W1.7-P0.95-LS2.8-BR
  rect 1.1x0.6 smd: 1(1.3,-0.95) 2(1.3,0) 3(1.3,0.95) 4(-1.3,0.95) 5(-1.3,-0.95)
SOT-363_L2.0-W1.3-P0.65-LS2.1-BR
  rect 0.9x0.4 smd: 1(0.9,-0.65) 2(0.9,0) 3(0.9,0.65) 4(-0.9,0.65) 5(-0.9,0) 6(-0.9,-0.65)
SW-SMD_TS24CA
  rect 0.9x1.2 smd: 1(-2.3,0.775) 2(2.3,0.775)
  rect 1.2x1.3 smd: 3(-1.675,-0.775) 4(1.675,-0.775)
USB-C-SMD_TYPE-C-6PIN-2MD-073
  rect 0.55x1.1 smd: 1(-3.2,2.375) 2(-2.4,2.375) 11(2.4,2.375) 12(3.2,2.375)
  rect 0.3x1.1 smd: 3(-1.75,2.375) 4(-1.25,2.375) 5(-0.75,2.375) 6(-0.25,2.375) 7(0.25,2.375) 8(0.75,2.375) 9(1.25,2.375) 10(1.75,2.375)
  oval 1.1x2 hole 0.6x1.5: 13(-4.325,1.825) 14(4.325,1.825)
  oval 1.2x1.8 hole 0.6x1.2: 13(-4.325,-2.375) 14(4.325,-2.375)
WIRELM-SMD_ESP32-S3-WROOM-1
  rect 1.5x0.9 smd: 1(-8.75,8.895) 2(-8.75,7.625) 3(-8.75,6.355) 4(-8.75,5.085) 5(-8.75,3.815) 6(-8.75,2.545) 7(-8.75,1.275) 8(-8.75,0.005) 9(-8.75,-1.265) 10(-8.75,-2.535) 11(-8.75,-3.805) 12(-8.75,-5.075) 13(-8.75,-6.345) 14(-8.75,-7.615) 27(8.75,-7.615) 28(8.75,-6.345) 29(8.75,-5.075) 30(8.75,-3.805) 31(8.75,-2.535) 32(8.75,-1.265) 33(8.75,0.005) 34(8.75,1.275) 35(8.75,2.545) 36(8.75,3.815) 37(8.75,5.085) 38(8.75,6.355) 39(8.75,7.625) 40(8.75,8.895)
  rect 0.9x1.5 smd: 15(-6.985,-8.895) 16(-5.715,-8.895) 17(-4.445,-8.895) 18(-3.175,-8.895) 19(-1.905,-8.895) 20(-0.635,-8.895) 21(0.635,-8.895) 22(1.905,-8.895) 23(3.175,-8.895) 24(4.445,-8.895) 25(5.715,-8.895) 26(6.985,-8.865)
  rect 0.9x0.9 smd: 41(-2.9,2.575) 41(-2.9,1.175) 41(-2.9,-0.225) 41(-1.5,2.575) 41(-1.5,1.175) 41(-1.5,-0.225) 41(-0.1,2.575) 41(-0.1,1.175) 41(-0.1,-0.225)

## Nets
As in the schematic.

Pads without a net: FPC6 1 2 3 4 8 14; LED4 2; SW1 1 2; SW2 1 2; SW3 1 2; SW4 1 2; SW5 1 2; U1 28 29 30; U2 7 8 9 10 11 12 15; USB1 3 9

## Via types
v1: diameter 0.61, hole 0.305, Top Layer to Bottom Layer, 206 vias

## Routing (per net, layer and track width the routed paths; a pad name or vN(x,y) marks a point on that pad's centre or on a via; arc(x,y) is an arc through that point)
3V3: length 262.4
  Top Layer w0.254: U2.16 31,2.92 R3.1 ; 15.21,31.37 14.61,31.97 FPC4.6 ; R24.1 1.29,11.41 v1(1.02,11.68) ; FPC6.33 25.15,20.42 ; v1(66.8,9.14) 66.8,12.18 67.18,12.56 R2.1 ; R21.2 v1(15.88,15.75)
  Top Layer w0.508: U4.4 56.73,12.03 v1(56.39,11.68) 55.75,11.68 ; R17.2 43.43,14.23 43.43,18.24 43.82,18.62 45.34,18.62 45.6,18.36 R16.2 R15.2 ; R17.2 R13.2 R12.2 R14.2 40.57,7.49 39.8,6.73 U2.4 37.85,6.73 34.04,2.92 U2.16 ; R17.2 45.22,11.68 v1(44.24,11.68) v1(43.56,11.68) ; R5.2 33.14,17.65 28.5,17.65 ; C9.2 14.92,31.08 15.21,31.37 ; R1.1 67.32,40.39 65.3,40.39 64.58,39.66 C2.2 ; v1(1.52,29.97) v1(1.52,31.24) 1.52,37.35 R19.1 14.99,49.02 27.48,49.02 R18.1 29.28,49.02 42.54,49.02 R20.1
  Top Layer w0.762: R5.2 34.55,18.93 35.69,20.07 38.48,20.07 41.96,16.59 43.43,16.59 ; 28.5,17.65 25.27,17.65 24.89,18.03 24.89,25.02 24.13,25.78 18.92,25.78 18.54,26.16
  Top Layer w1.016: 18.92,29.84 22.86,33.78 25.53,33.78 ; U1.2 64.65,39.05 C2.2 62.29,41.4 38.1,41.4 30.35,33.66
  Bottom Layer w0.254: v1(15.88,15.75) 15.88,25.02 14.61,26.29 10.41,26.29 v1(9.14,25.02) ; v1(56.39,11.68) 64.26,11.68 v1(66.8,9.14) ; v1(1.02,11.68) 1.52,12.19 v1(1.52,29.97)
  Bottom Layer w0.508: v1(43.56,11.68) v1(44.24,11.68) v1(55.71,11.68) v1(56.39,11.68)
  vias: v1(6.38,31.17) v1(6.35,30.1)
+5V: length 168.6
  Top Layer w0.381: C8.2 v1(65.15,0.95)
  Top Layer w0.508: C8.2 68.12,0.95 LED4.1 ; 6.1,11.18 6.1,7.47 USB1.2 ; 7.34,11.3 9.27,11.3 10.91,9.66 USB1.11 ; R23.2 3.43,11.18
  Top Layer w0.762: 17.27,47.75 43.43,47.75 48.89,53.21 51.43,53.21 52.58,52.07 52.58,48.51 52.7,48.39
  Top Layer w1.016: 7.34,11.3 7.22,11.18 3.43,11.18 1.4,13.21 1.4,23.62 3.17,25.4 3.17,33.66 17.27,47.75
  Bottom Layer w0.381: v1(6.48,9.27) v1(6.48,8.65) 6.48,5.97 7.75,4.7 13.72,4.7 16,2.41 63.69,2.41 v1(65.15,0.95)
GND: length 387.2
  Top Layer w0.254: 12.06,34.29 12.06,34.75 FPC4.8 ; 12.06,34.29 12.06,31.7 FPC4.7 ; 12.06,34.29 13.12,34.29 13.31,34.47 FPC4.1 20.89,34.47 24.85,38.44 25.87,38.44 ; 27.05,28.7 27.27,28.92 FPC6.16 ; FPC6.40 24.66,16.92 v1(23.75,16.01) ; v1(23.75,22.86) 23.75,21.96 ; 23.75,21.96 v1(23.75,20.73) v1(23.75,19.05) v1(23.75,16.01) ; 23.75,21.96 20.32,21.96 ; v1(27.05,25.4) 27.05,24.64 27.27,24.42 FPC6.25 ; v1(23.75,16.01) 25.08,16.01 FPC6.41 ; FPC6.13 27.05,30.42 ; 25.87,38.44 FPC6.42 27.05,36.93 27.05,34.8 27.43,34.42 FPC6.5 ; 25.87,38.44 26.29,38.44 ; 25.87,38.44 25.87,39.67 v1(24.64,40.89) ; FPC6.37 26.79,18.42 v1(26.16,19.05)
  Top Layer w0.381: 59.18,50.93 60.92,50.93 61.19,51.2 v1(63.63,51.2)
  Top Layer w0.508: 2.82,1.15 2.82,3.16 R10.2 ; 65.92,15.31 69.15,15.31 SW2.3 ; U1.1 65.98,35.48 C1.2 C2.1 69.17,39.12 ; C9.1 12.14,30.97 FPC4.7 ; U4.10 51.34,4.48 52.07,5.21 64.81,5.21 U4.10 66.67,3.34 C8.1 ; USB1.13 4.76,6.91 USB1.1 ; C3.2 69.17,40.28 69.17,39.12 ; 10.09,49.78 10.09,50.45 9.12,51.42 v1(7.37,51.42) ; v1(21.59,51.42) 23.22,51.42 24.3,50.34 C10.2 ; 69.17,39.12 70.75,39.12 SW1.4 70.98,41.01 v1(70.99,41.02) ; 11.68,10.41 11.71,10.39 USB1.12 12.28,7.45 USB1.14 ; C12.2 39.8,50.45 38.84,51.42 38.34,51.42 v1(37.08,50.16) ; U4.6 54.54,13.51 54.36,13.33 50.48,13.33 U4.10 49.84,13.59 v1(48.77,13.59)
  Top Layer w0.762: U2.1 40.13,1.6 40.13,1.52 62.58,1.52 U4.10 ; USB1.13 2.33,6.91 1.4,5.97 1.4,3.94 2.16,3.17 3.71,3.17 USB1.13 USB1.14 13.43,3.3 15.37,3.3 15.88,3.81 15.88,5.97 14.94,6.91 USB1.14 ; 65.92,32.14 v1(65.92,33.29) ; 65.92,32.14 v1(65.92,30.79) v1(65.92,28.54) v1(65.92,25.79) v1(65.92,22.99) U1.40 v1(65.92,15.98) 65.92,15.31 U4.10 65.54,13.13 U4.10 ; 65.92,32.14 v1(64.62,30.84) 63.35,29.57 59.95,29.57 ; v1(65.92,33.29) U1.1 ; v1(65.92,33.29) 65.92,33.85 ; 26.29,38.44 v1(31.42,43.58) 34.46,46.61 45.72,46.61 50.31,51.2 ; 61.2,43.47 60.27,42.54 47.5,42.54 44.7,45.34 ; U4.10 69.65,4.48 LED4.3
  Top Layer w1.016: FPC7.18 61.2,43.47 ; 44.7,45.34 44.7,46.23
  Bottom Layer w0.254: 24.26,31.37 24.31,31.37 v1(27.05,28.63) ; 27.05,34.8 v1(27.05,30.42) v1(27.05,28.63) ; 12.43,51.42 14.11,51.42 v1(24.64,40.89) ; v1(27.05,28.63) v1(27.05,25.4) 27.05,23.62 26.16,22.73 v1(26.16,19.05) 26.16,15.66 26.29,15.54
  Bottom Layer w0.381: v1(70.99,41.02) 70.99,43.83 v1(64.61,50.22) v1(63.63,51.2)
  Bottom Layer w0.508: v1(48.77,14.73) 44.7,14.73 33.78,3.81 19.43,3.81 v1(18.67,4.57) ; v1(7.37,51.42) 12.43,51.42 13.97,52.96 20.45,52.96 21.34,52.07 21.34,51.68 v1(21.59,51.42)
  vias: v1(2.79,45.96) v1(2.79,42.93) v1(5.72,45.47) v1(5.84,48.26) v1(8,47.62) v1(13.93,40.86) v1(13.97,37.97) v1(14.22,20.95) v1(14.22,17.78) v1(18.54,40.89) v1(18.58,37.97) v1(18.54,10.41) v1(18.67,21.76) v1(18.67,19.48) v1(18.67,17.4) v1(18.67,15.14) v1(18.67,12.14) v1(18.67,6.82) v1(18.67,1.27) v1(18.8,45.59) v1(20.7,21.84) v1(20.7,19.43) v1(20.7,17.4) v1(20.7,15.11) v1(21.08,12.52) v1(21.89,40.89) v1(21.89,37.97) v1(22.1,6.86) v1(22.1,4.44) v1(22.1,1.14) v1(22.35,10.92) v1(23.88,27.69) v1(25.18,6.86) v1(25.18,4.44) v1(25.18,1.14) v1(26.04,26.92) v1(25.97,10.92) v1(26.42,45.08) v1(26.92,42.04) v1(30.86,15.75) v1(32,39.62) v1(34.67,40) v1(35.18,45.08) v1(35.18,42.67) v1(38.99,45.08) v1(38.94,42.67) v1(39.24,1.02) v1(43.45,1.02) v1(45.76,47.24) v1(47.52,1.02) v1(49.12,47.24) v1(50.17,31.37) v1(50.29,33.15) v1(51.63,1.02) v1(52.58,47.24) v1(53.47,33.15) v1(53.59,31.5) v1(53.85,28.96) v1(53.85,26.75) v1(54.99,4.95) v1(54.99,3.68) v1(55.52,1.02) v1(56.57,31.62) v1(56.64,32.77) v1(56.9,4.95) v1(56.84,3.68) v1(58.8,46.61) v1(58.8,44.07) v1(59.49,1.02) v1(60.04,31.62) v1(60.07,32.77) v1(60.29,46.61) v1(60.35,44.07) v1(62.99,23.88) v1(63.75,16) v1(64.64,47.62) v1(64.64,45.34) v1(64.64,43.05) v1(64.64,33.27) v1(64.64,28.57) v1(64.64,25.91) v1(67.18,14.22) v1(67.56,47.69) v1(67.56,45.34) v1(67.64,43.05) v1(69.31,14.22) v1(71.02,47.56) v1(71.02,45.29)
DN: length 36.1
  Top Layer w0.254: USB1.7 8.76,9.51 ; 8.76,9.51 7.76,8.51 USB1.5 ; 8.76,9.51 8.76,9.51 v1(8.76,10.29) ; U2.6 v1(36.32,9.27)
  Bottom Layer w0.254: v1(36.32,9.27) 35.94,8.89 10.16,8.89 v1(8.76,10.29)
DP: length 36.3
  Top Layer w0.254: USB1.6 8.26,5.97 8.76,5.46 ; 8.76,5.46 9.26,5.96 USB1.8 ; 8.76,5.46 v1(8.76,6.35) ; U2.5 v1(36.32,8)
  Bottom Layer w0.254: v1(36.32,8) 35.94,8.38 10.8,8.38 v1(8.76,6.35)
DTR: length 6.1
  Top Layer w0.254: Q1.4 27.92,6.87 28.58,6.22 Q1.2 32.56,6.22 U2.13
EN: length 68.8
  Top Layer w0.254: v1(63.37,36.96) 63.37,35.42 U1.3 63.37,35.41 63.37,31.62 62.48,30.73 52.32,30.73 v1(50.17,28.57) ; Q1.6 26.84,5.57 26.42,6 26.42,8.76 v1(36.7,19.05) ; v1(65.79,41.78) 67.43,41.78 R1.2
  Top Layer w0.508: SW1.3 70.01,41.72 C3.1 69.16,41.77 R1.2
  Bottom Layer w0.254: v1(65.79,41.78) 65.79,39.37 v1(63.37,36.96) ; v1(50.17,28.57) 43.43,28.57 36.7,21.84 v1(36.7,19.05)
IO0: length 56.4
  Top Layer w0.254: v1(49.53,19.05) 49.53,18.04 U1.27 48.91,18.41 47.24,18.41 45.97,19.68 43.56,19.68 v1(42.04,18.16) ; 37.34,18.16 31.75,12.57 31.75,9.4 Q1.3 ; SW2.4 70.06,11.06 R2.2 67.81,11.06 v1(67.69,11.18)
  Bottom Layer w0.254: v1(49.53,19.05) 50.29,19.81 54.74,19.81 55.12,19.43 55.12,16.64 57.4,14.35 64.52,14.35 v1(67.69,11.18) ; v1(37.59,18.16) v1(42.04,18.16)
IO1: length 45.4
  Top Layer w0.254: v1(42.04,19.81) 38.24,23.61 R4.1 ; v1(52.96,22.86) 55.37,22.86 58.55,19.68 61.72,19.68 62.94,20.9 64.06,20.9 v1(64.64,20.32) 64.65,20.31 U1.39
  Bottom Layer w0.254: v1(42.04,19.81) 42.04,26.03 43.94,27.94 46.23,27.94 51.31,22.86 v1(52.96,22.86)
IO2: length 79.4
  Top Layer w0.254: FPC4.2 18.48,33.97 v1(18.92,33.53) ; FPC6.15 v1(23.11,29.42) ; v1(63.37,20.32) 63.37,17.92 U1.38
  Bottom Layer w0.254: v1(23.11,29.42) 22.31,30.23 22.23,30.23 ; 22.23,30.23 22.23,14.99 23.37,13.84 42.63,13.84 50.2,21.41 62.28,21.41 v1(63.37,20.32) ; 22.23,30.23 v1(18.92,33.53)
IO3: length 20.8
  Top Layer w0.254: U1.15 41.66,33.66 38.92,30.92 FPC6.12
IO4: length 40.8
  Top Layer w0.254: U1.4 62.1,35.42 v1(62.1,38.99) ; FPC6.11 30.91,31.42 38.99,39.5 57.4,39.5 v1(57.91,38.99)
  Bottom Layer w0.254: v1(57.91,38.99) v1(62.1,38.99)
IO5: length 39.8
  Top Layer w0.254: v1(60.83,38.1) 60.83,35.42 U1.5 ; v1(58.8,38.1) 58.8,39.12 57.91,40 38.73,40 30.65,31.92 FPC6.10
  Bottom Layer w0.254: v1(58.8,38.1) v1(60.83,38.1)
IO6: length 38.9
  Top Layer w0.254: U1.6 59.57,39.36 58.42,40.51 38.48,40.51 30.39,32.42 FPC6.9
IO7: length 45.1
  Top Layer w0.254: v1(36.58,31.75) 36.58,35.81 39.24,38.48 57.15,38.48 58.29,37.34 58.29,35.42 U1.7 ; FPC6.24 35.79,24.92 v1(36.45,24.26)
  Bottom Layer w0.254: v1(36.58,31.75) 36.58,24.38 v1(36.45,24.26)
IO8: length 38.2
  Top Layer w0.254: FPC6.23 36.56,25.42 v1(37.72,24.26) ; U1.12 51.95,36.82 50.93,37.85 39.75,37.85 37.72,35.81 v1(37.72,31.75)
  Bottom Layer w0.254: v1(37.72,31.75) v1(37.72,24.26)
IO9: length 21.6
  Top Layer w0.254: v1(45.85,31.11) U1.17 ; FPC6.20 39.08,26.92 v1(39.33,26.67)
  Bottom Layer w0.254: v1(45.85,31.11) 43.78,31.11 v1(39.33,26.67)
IO10: length 21.6
  Top Layer w0.254: FPC6.21 38.6,26.42 v1(39.24,25.78) ; U1.18 48,29.72 v1(45.85,29.72)
  Bottom Layer w0.254: v1(45.85,29.72) 43.56,29.72 39.62,25.78 v1(39.24,25.78)
IO11: length 39.6
  Top Layer w0.254: U1.19 49.02,28.57 50.8,26.8 52.7,26.8 53.98,25.53 59.94,25.53 60.83,24.64 v1(60.83,20.83) ; 57.83,15.08 57.79,15.03 57.79,11.3 57.02,10.54 R13.1
  Bottom Layer w0.254: v1(60.83,20.83) 57.83,17.83 v1(57.83,15.39)
IO12: length 31.7
  Top Layer w0.254: 47.24,12.06 54.99,12.06 55.64,12.71 U4.5 ; R17.1 47.11,12.84 46.61,13.33 45.21,13.33 44.58,13.97 v1(44.58,17.91) ; U1.20 v1(44.58,27.3)
  Bottom Layer w0.254: v1(44.58,17.91) v1(44.58,27.3)
IO13: length 20.7
  Top Layer w0.254: FPC6.17 41.43,28.42 43.82,26.03 U1.21
IO14: length 21
  Top Layer w0.254: FPC6.18 40.91,27.92 44.07,24.77 U1.22
IO15: length 35.4
  Top Layer w0.254: FPC6.22 37.71,25.92 v1(38.48,25.15) ; U1.8 57.03,34.61 56.46,34.04 v1(49.66,34.04)
  Bottom Layer w0.254: v1(38.48,25.15) 38.48,28.19 44.32,34.04 v1(49.66,34.04)
IO16: length 62.3
  Top Layer w0.254: v1(55.88,50.16) 56,50.04 FPC7.9 56.01,48.44 v1(56.01,44.7) ; U1.9 55.75,35.42 v1(55.75,37.21)
  Top Layer w0.508: v1(15.49,51.43) R19.2 12.47,51.43 12.47,51.42 12.47,50.77 C11.1
  Bottom Layer w0.254: v1(55.88,50.16) 54.23,48.51 18.41,48.51 v1(15.49,51.43) ; v1(55.75,37.21) 55.75,44.45 v1(56.01,44.7)
IO17: length 15.5
  Top Layer w0.254: v1(54.48,37.21) 54.48,35.42 U1.10 ; FPC7.11 57,44.87 56.07,43.94 v1(54.1,43.94)
  Bottom Layer w0.254: v1(54.48,37.21) 54.48,43.56 v1(54.1,43.94)
IO18: length 17.3
  Top Layer w0.254: 53.21,43.56 53.47,43.31 56.64,43.31 57.5,44.17 FPC7.12 ; U1.11 53.22,37.21 v1(53.21,37.21)
  Bottom Layer w0.254: v1(53.21,37.21) 53.09,37.34 v1(53.09,43.69)
IO19: length 41.4
  Top Layer w0.254: U1.13 50.67,35.42 50.67,36.58 50.42,36.83 v1(48.39,36.83) ; FPC4.5 15.28,32.47 v1(15.37,32.38)
  Bottom Layer w0.254: v1(48.39,36.83) 47.37,35.81 16.38,35.81 15.37,34.8 v1(15.37,32.38)
IO20: length 38.3
  Top Layer w0.254: v1(48.13,35.18) 49.17,35.18 U1.14 ; v1(16.26,32.64) 15.92,32.97 FPC4.4
  Bottom Layer w0.254: v1(48.13,35.18) 48.01,35.31 16.72,35.31 16.26,34.84 v1(16.26,32.64)
IO21: length 21.4
  Top Layer w0.254: FPC6.19 40.14,27.42 44.2,23.37 48,23.37 U1.23
IO38: length 23.5
  Top Layer w0.254: U1.31 54.48,17.92 v1(54.48,19.18) ; LED4.4 68.86,8.36 v1(68.83,8.38)
  Bottom Layer w0.254: v1(54.48,19.18) 54.48,16.26 57.66,13.08 64.14,13.08 v1(68.83,8.38)
IO39: length 60.7
  Top Layer w0.254: v1(58.42,20.83) 58.42,23.24 v1(59.69,24.51) ; U1.32 v1(55.76,19.18) ; v1(56.52,51.56) 56.5,51.55 FPC7.10
  Top Layer w0.508: C12.1 41.21,50.44 42.19,51.43 R20.2 44.06,51.43 v1(44.83,52.2)
  Bottom Layer w0.254: v1(58.42,20.83) 58.42,20.45 57.15,19.18 v1(55.76,19.18) ; v1(44.83,52.2) 45.47,51.56 v1(56.52,51.56) 58.17,51.56 62.74,46.99 62.74,27.56 v1(59.69,24.51)
IO40: length 65.8
  Top Layer w0.254: v1(57.02,20.32) 57.02,17.92 U1.33 ; v1(18.8,32.77) 18.09,33.47 FPC4.3
  Bottom Layer w0.254: v1(18.8,32.77) 21.72,29.84 21.72,14.73 23.24,13.21 42.5,13.21 49.61,20.32 v1(57.02,20.32)
IO41: length 14.2
  Top Layer w0.254: U1.34 58.29,17.91 58.29,17.02 58.04,16.76 53.94,16.76 ; 53.43,15.08 53.43,16.01 53.94,16.51 53.94,16.76 47.49,16.76 R16.1
IO42: length 20.1
  Top Layer w0.254: R12.1 57.4,9.02 58.93,10.54 58.93,15.07 58.93,15.08 58.93,16.41 59.57,17.04 U1.35
IO45: length 50.4
  Top Layer w0.254: 52.33,15.08 52.33,16.12 52.2,16.26 48.63,16.26 R15.1 46.36,15.49 v1(46.36,18.41) ; v1(51.31,24.13) 50.88,24.13 50.42,23.67 50.42,20.7 49.4,19.68 U1.26 47.12,19.68 v1(46.36,20.45) ; v1(49.53,46.1) 52.43,46.1 54,47.67 FPC7.5
  Bottom Layer w0.254: v1(49.53,46.1) 49.53,36.96 51.31,35.18 v1(51.31,24.13) ; v1(46.36,20.45) v1(46.36,18.41)
IO46: length 63
  Top Layer w0.254: v1(54.99,33.4) 53.98,32.38 U1.16 ; FPC7.8 55.5,49.4 v1(54.74,50.16)
  Top Layer w0.508: C10.1 26.57,50.92 26.57,51.42 28.37,51.42 R18.2 30.11,51.43 v1(30.86,50.67)
  Bottom Layer w0.254: v1(30.86,50.67) 31.29,51.1 43.13,51.1 43.94,50.29 54.61,50.29 ; v1(54.74,50.16) 55.37,50.8 56.39,50.8 56.77,50.42 56.77,37.72 58.29,36.19 58.29,33.91 57.79,33.4 v1(54.99,33.4)
IO47: length 73.1
  Top Layer w0.254: v1(60.04,16.13) U4.1 60.07,15.04 60.07,9.27 58.29,7.49 R14.1 ; v1(52.83,25.65) 50.67,25.65 49.4,24.38 49.4,22.61 49.02,22.22 U1.24 ; v1(51.82,44.58) 52.96,44.58 55,46.62 FPC7.7
  Bottom Layer w0.254: v1(51.82,44.58) 51.82,36.45 52.83,35.43 v1(52.83,25.65) 52.83,24.64 55.24,22.22 62.61,22.22 64.01,20.83 64.01,20.1 v1(60.04,16.13)
IO48: length 47.8
  Top Layer w0.254: v1(50.93,45.34) 52.58,45.34 54.5,47.26 FPC7.6 ; R25.2 45.35,21.34 47.75,21.34 U1.25 49.66,20.95 49.91,21.21 49.91,24 50.8,24.89 v1(52.07,24.89) 52.07,23.88 51.69,23.49 v1(51.69,19.18)
  Bottom Layer w0.254: v1(50.93,45.34) 50.93,36.32 52.07,35.18 v1(52.07,24.89) ; v1(51.69,19.18) 51.18,18.67 v1(51.18,15.37)
RTS: length 6
  Top Layer w0.254: Q1.5 27.99,6.22 28.64,5.57 Q1.1 32.96,5.57 U2.14
RXD: length 40.4
  Top Layer w0.254: U2.2 37.72,4.19 37.12,3.59 37.12,1.02
  Top Layer w0.508: 60.71,17.92 60.96,17.67 v1(60.96,9.52) ; U2.2 46.48,4.19 47.88,2.79 57.4,2.79 v1(58.04,3.43)
  Bottom Layer w0.508: v1(60.96,9.52) 60.96,6.35 v1(58.04,3.43)
TXD: length 41.2
  Top Layer w0.254: 34.07,1.02 34.07,1.69 37.85,5.46 U2.3
  Top Layer w0.508: U1.37 62.11,8.01 60.33,6.22 40.7,6.22 39.94,5.46 U2.3
$1N3136: length 5.3
  Top Layer w0.254: R3.2 30.86,1.27 LED2.2 33.23,0.51 34.76,0.51 LED1.2
$1N4482: length 1.6
  Top Layer w0.508: Q2.3 32.06,20.13 R6.1
$1N4584: length 4
  Top Layer w0.508: R5.1 R4.2 33.58,22.95 Q2.1
$1N6260: length 6.8
  Top Layer w0.254: USB1.4 7.24,7.43 7.24,5.59 6.47,4.82 R10.1
$1N6275: length 6.4
  Top Layer w0.254: 14.35,4.69 14.22,4.83 10.92,4.83 10.29,5.46 10.29,7.43 USB1.10
$1N13305: length 17.7
  Top Layer w0.254: v1(12.95,14.22) 12.56,14.62 U5.1 ; v1(4.95,9.4) 3.8,9.4 R23.1
  Bottom Layer w0.254: v1(12.95,14.22) 14.35,12.83 14.35,11.05 13.72,10.41 10.29,10.41 9.4,11.3 6.86,11.3 v1(4.95,9.4)
$1N13462: length 7.9
  Top Layer w0.254: R24.2 v1(1.29,7.87) ; 1.22,1.14 v1(1.22,2.41)
  Bottom Layer w0.254: v1(1.29,7.87) 1.22,7.8 v1(1.22,2.41)
$1N13468: length 3.4
  Top Layer w0.508: U5.5 12.85,13.22 R22.2 R21.1

## Copper pours and planes (outline as drawn; the poured copper is in the pictures)
3V3 on Top Layer: 4.19,24.51 10.8,24.51 10.8,16.51 4.19,16.51
3V3 on Top Layer: 24,34.04 30.73,34.04 30.73,33.27 24,33.27
3V3 on Top Layer: 5.84,32.26 20.19,32.26 20.19,23.3 5.84,23.3
3V3 on Bottom Layer: 1.14,31.62 7.49,31.62 7.49,29.72 1.14,29.72
+5V on Top Layer: 51.82,50.42 53.59,50.42 53.59,47.88 51.82,47.88
+5V on Top Layer: 5.81,11.18 6.86,11.18 6.86,8.38 5.81,8.38
+5V on Top Layer: 6.35,13.84 11.05,13.84 11.05,9.65 6.35,9.65
GND on Top Layer: 57.82,51.56 59.69,51.56 59.69,47.98 57.82,47.98
GND on Top Layer: 11.3,16.76 11.94,16.76 11.94,13.97 11.3,13.97
GND on Top Layer: 0.13,52.96 72.26,52.96 72.26,0.25 0.13,0.25
GND on Top Layer: 11.04,24.52 20.81,24.52 20.81,0.51 11.04,0.51
GND on Top Layer: 26.13,24.42 30.73,24.42 30.73,20.83 26.13,20.83
GND on Top Layer: 48.39,15.37 50.4,15.37 50.4,12.65 48.39,12.65
GND on Top Layer: 56.01,30.23 60.46,30.23 60.46,26.05 56.01,26.05
GND on Bottom Layer: 0.13,53.21 72.26,53.21 72.26,0.51 0.13,0.51
GND on Bottom Layer: 48.39,15.37 50.42,15.37 50.42,12.7 48.39,12.7
LEDK on Top Layer: 27.69,20.07 31.1,20.07 31.1,18.77 27.69,18.77
$1N13069 on Top Layer: 5.76,16.13 10.93,16.13 10.93,12.19 5.76,12.19

## Text on the board
Top Silkscreen Layer: Touch | Power | LCD | UART | ESP32S3 LVGL
